# EAGLE design Schematic (EAGLE 9.6.2)

## Sheet 1 of 2
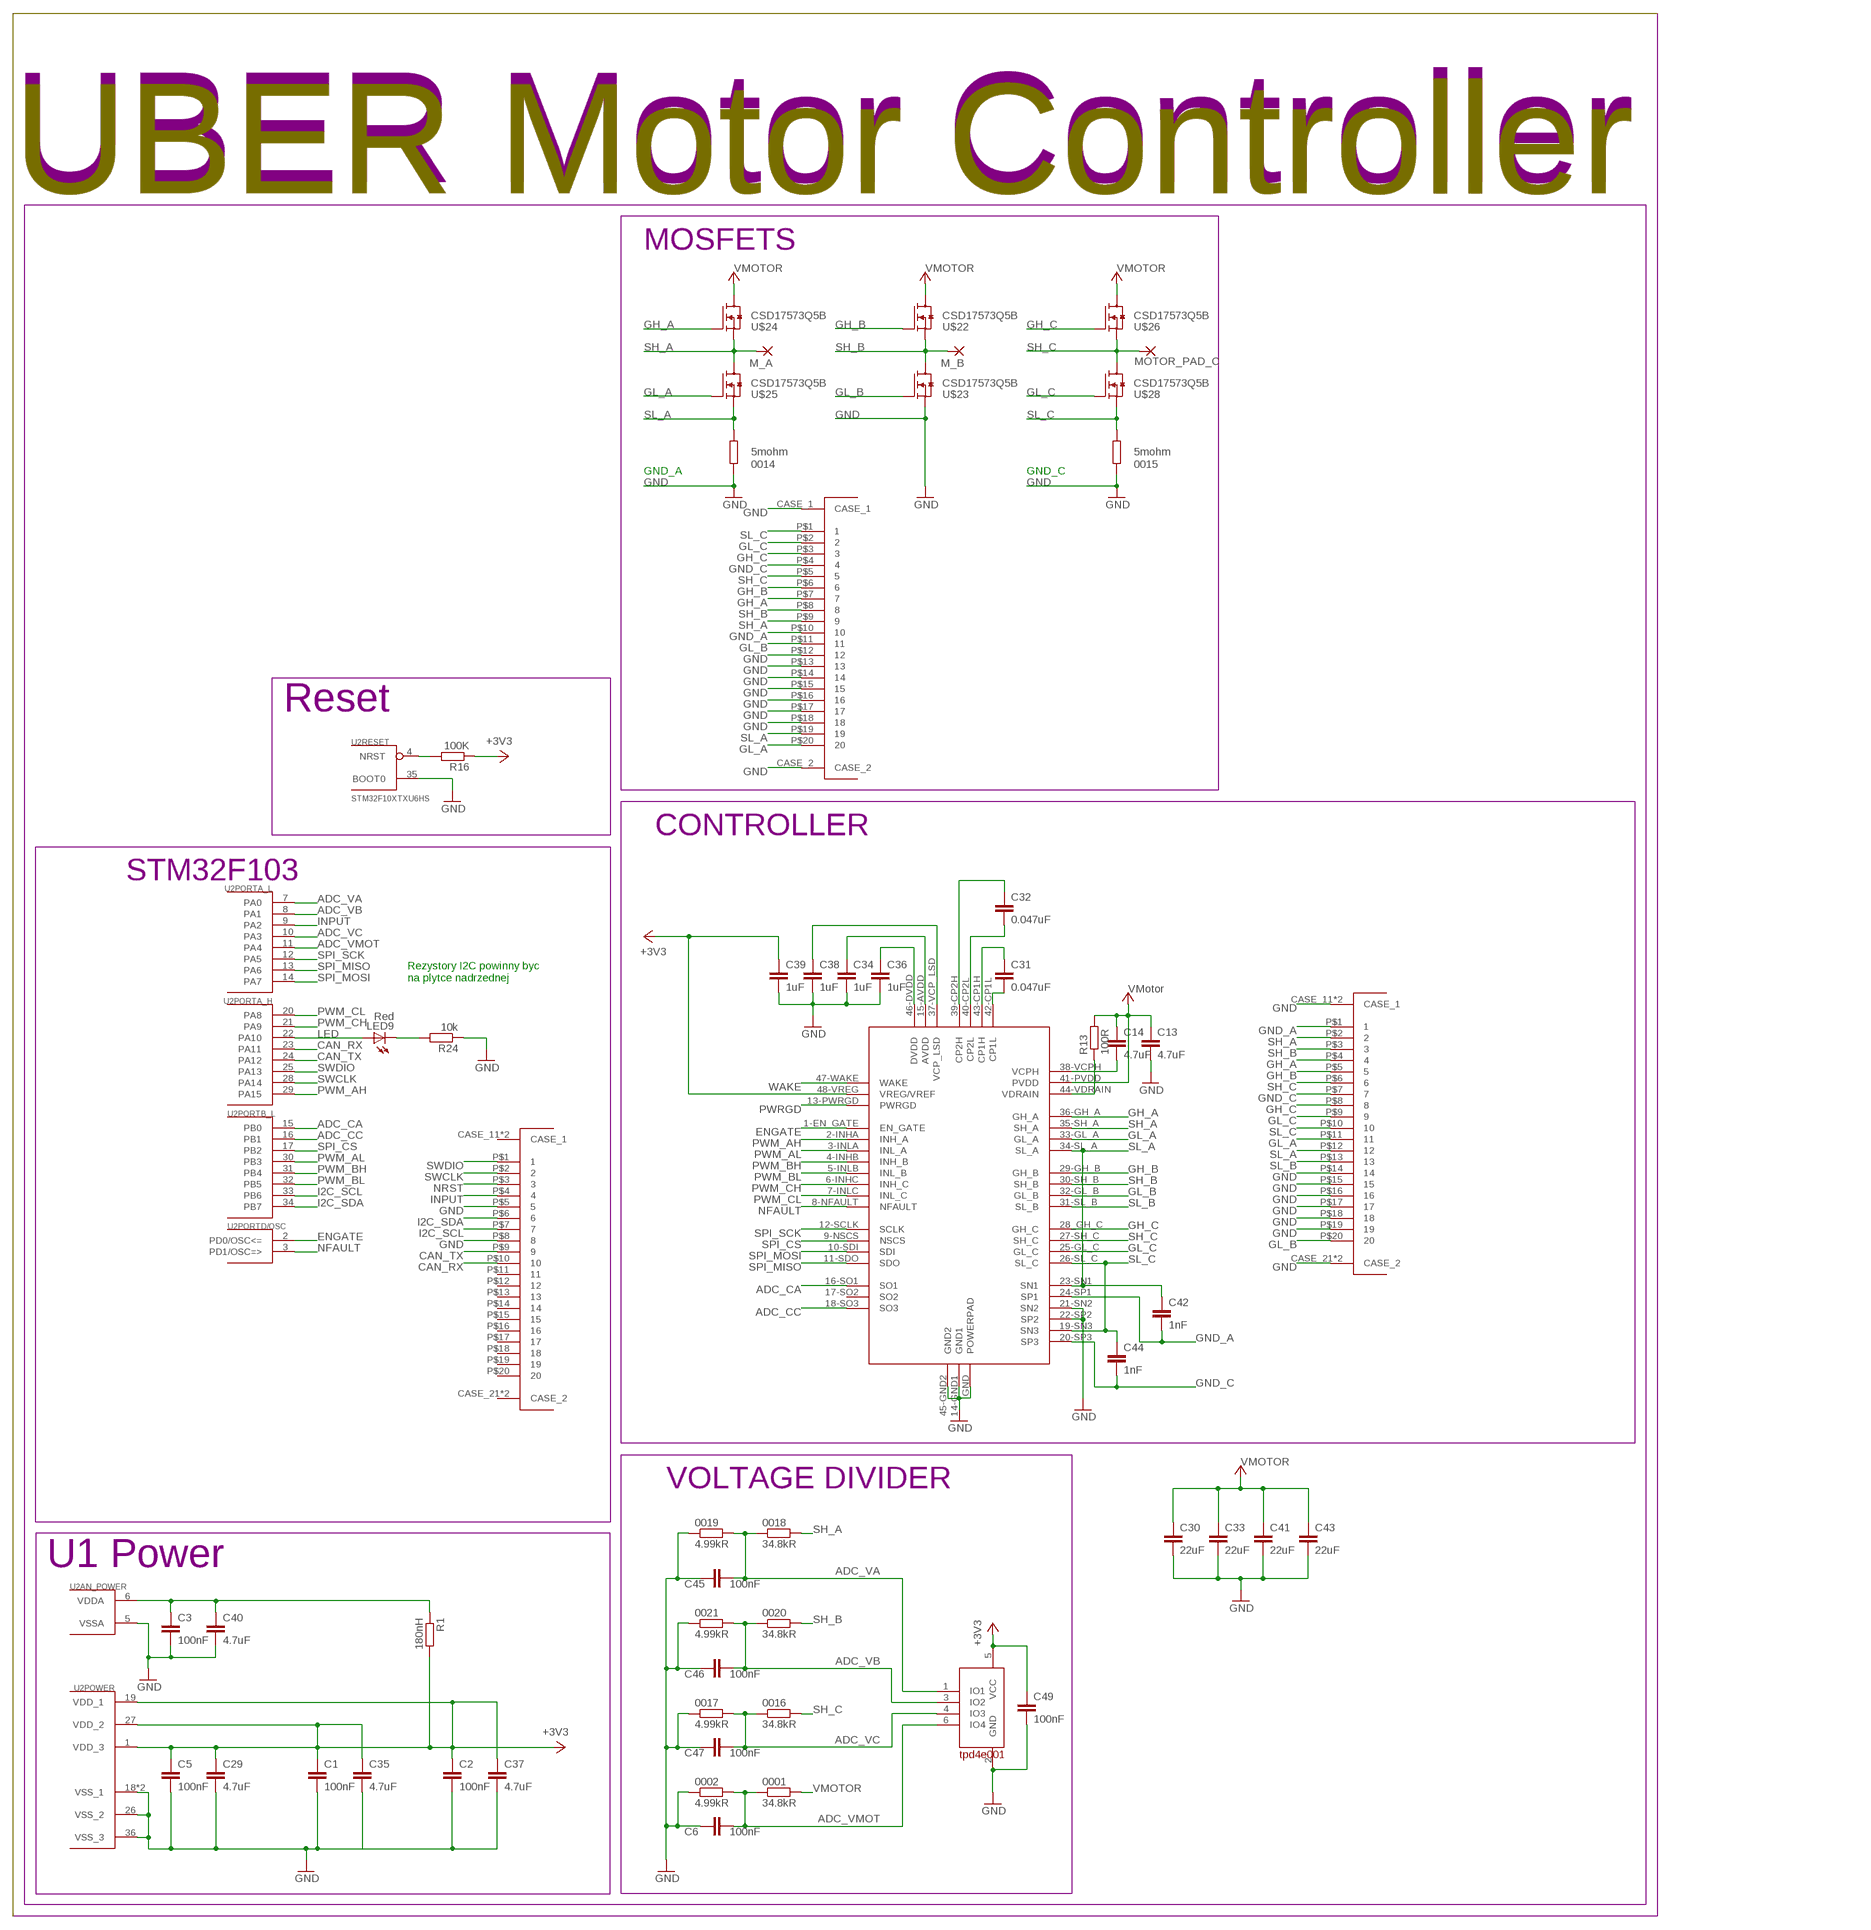
[diagram p0: schematic, sheet 1]

### Parts
0001  34.8kR  R-EU_R0402  [R0402]
0002  4.99kR  R-EU_R0402  [R0402]
0014  5mohm  R-EU_R2512  [R2512]
0015  5mohm  R-EU_R2512  [R2512]
0016  34.8kR  R-EU_R0402  [R0402]
0017  4.99kR  R-EU_R0402  [R0402]
0018  34.8kR  R-EU_R0402  [R0402]
0019  4.99kR  R-EU_R0402  [R0402]
0020  34.8kR  R-EU_R0402  [R0402]
0021  4.99kR  R-EU_R0402  [R0402]
C1  100nF  C-EU  [R0402]
C2  100nF  C-EU  [R0402]
C3  100nF  C-EU  [R0402]
C5  100nF  C-EU  [R0402]
C6  100nF  C-EU  [R0402]
C13  4.7uF  C-EUC0805  [C0805]
C14  4.7uF  C-EUC0805  [C0805]
C29  4.7uF  C-EU  [R0402]
C30  22uF  C-EUC1206  [C1206]
C31  0.047uF  C-EU  [R0402]
C32  0.047uF  C-EU  [R0402]
C33  22uF  C-EUC1206  [C1206]
C34  1uF  C-EU  [R0402]
C35  4.7uF  C-EU  [R0402]
C36  1uF  C-EU  [R0402]
C37  4.7uF  C-EU  [R0402]
C38  1uF  C-EU  [R0402]
C39  1uF  C-EU  [R0402]
C40  4.7uF  C-EU  [R0402]
C41  22uF  C-EUC1206  [C1206]
C42  1nF  C-EU  [R0402]
C43  22uF  C-EUC1206  [C1206]
C44  1nF  C-EU  [R0402]
C45  100nF  C-EU  [R0402]
C46  100nF  C-EU  [R0402]
C47  100nF  C-EU  [R0402]
C49  100nF  C-EU  [R0402]
LED9  Red  LEDSML0603  [SML0603]
M_A  SMD5  [SMD2,54-5,08]
M_B  SMD5  [SMD2,54-5,08]
MOTOR_PAD_C  SMD5  [SMD2,54-5,08]
R1  180nH  R-EU_R0603  [R0603]
R13  100R  R-EU_R0603  [R0603]
R16  100K  R-EU_R0402  [R0402]
R24  10k  R-EU_R0402  [R0402]
U2  STM32F10XTXU6HS  [VFQFPN36-HS]
U$1  RECEPTACLE_20_0.4_5024262030  [RECEPTACLE_20_0.4_5024262030]
U$21  DRV8305  [S-PQFP-G48]
U$22  CSD17573Q5B  [Q5B]
U$23  CSD17573Q5B  [Q5B]
U$24  CSD17573Q5B  [Q5B]
U$25  CSD17573Q5B  [Q5B]
U$26  CSD17573Q5B  [Q5B]
U$28  CSD17573Q5B  [Q5B]
U$30  PLUG_20_0.4_5024302012  [PLUG_20_0.4_5024302012]
U$31  TPD4E001  [SOT-23]
U$32  RECEPTACLE_20_0.4_5024262030  [RECEPTACLE_20_0.4_5024262030]

### Nets
+3V3: C1.1 C2.1 C5.1 C29.1 C35.1 C37.1 C39.1 C49.1 R1.2 R16.1 U2.1(POWER:VDD_3) U2.19(POWER:VDD_1) U2.27(POWER:VDD_2) U$21.48-VREG(VREG/VREF) U$31.5(VCC)
ADC_CA: U2.15(PORTB_L:PB0) U$21.16-SO1(SO1)
ADC_CC: U2.16(PORTB_L:PB1) U$21.18-SO3(SO3)
ADC_VA: 0018.1 0019.2 C45.1 U2.7(PORTA_L:PA0) U$31.1(IO1)
ADC_VB: 0020.1 0021.2 C46.1 U2.8(PORTA_L:PA1) U$31.3(IO2)
ADC_VC: 0016.1 0017.2 C47.1 U2.10(PORTA_L:PA3) U$31.4(IO3)
ADC_VMOT: 0001.1 0002.2 C6.1 U2.11(PORTA_L:PA4) U$31.6(IO4)
CAN_RX: U2.23(PORTA_H:PA11) U$1.P$10
CAN_TX: U2.24(PORTA_H:PA12) U$1.P$9
ENGATE: U2.2(PORTD/OSC:PD0/OSC<=) U$21.1-EN_GATE(EN_GATE)
GH_A: U$21.36-GH_A(GH_A) U$24.G U$30.P$7 U$32.P$4
GH_B: U$21.29-GH_B(GH_B) U$22.G U$30.P$6 U$32.P$5
GH_C: U$21.28_GH_C(GH_C) U$26.G U$30.P$3 U$32.P$8
GL_A: U$21.33-GL_A(GL_A) U$25.G U$30.P$20 U$32.P$11
GL_B: U$21.32-GL_B(GL_B) U$23.G U$30.P$11 U$32.P$20
GL_C: U$21.25-GL_C(GL_C) U$28.G U$30.P$2 U$32.P$9
GND: 0002.1 0014.1 0015.1 0017.1 0019.1 0021.1 C1.2 C2.2 C3.2 C5.2 C6.2 C13.2 C29.2 C30.2 C33.2 C34.2 C35.2 C36.2 C37.2 C38.2 C39.2 C40.2 C41.2 C43.2 C45.2 C46.2 C47.2 C49.2 R24.1 U2.5(AN_POWER:VSSA) U2.18(POWER:VSS_1) U2.26(POWER:VSS_2) U2.35(RESET:BOOT0) U2.36(POWER:VSS_3) U2.GND(POWER:VSS_1) U$1.P$5 U$1.P$8 U$21.14-GND1(GND1) U$21.21-SN2(SN2) U$21.22-SP2(SP2) U$21.45-GND2(GND2) U$21.GND(POWERPAD) U$23.S U$30.CASE_1 U$30.CASE_2 U$30.P$12 U$30.P$13 U$30.P$14 U$30.P$15 U$30.P$16 U$30.P$17 U$30.P$18 U$31.2(GND) U$32.CASE_11(CASE_1) U$32.CASE_12(CASE_1) U$32.CASE_21(CASE_2) U$32.CASE_22(CASE_2) U$32.P$14 U$32.P$15 U$32.P$16 U$32.P$17 U$32.P$18 U$32.P$19
GND_A: C42.2 U$21.24-SP1(SP1) U$30.P$10 U$32.P$1
GND_C: C44.2 U$21.20-SP3(SP3) U$30.P$4 U$32.P$7
I2C_SCL: U2.33(PORTB_L:PB6) U$1.P$7
I2C_SDA: U2.34(PORTB_L:PB7) U$1.P$6
INPUT: U2.9(PORTA_L:PA2) U$1.P$4
LED: LED9.A U2.22(PORTA_H:PA10)
N$2: C3.1 C40.1 R1.1 U2.6(AN_POWER:VDDA)
N$10: C36.1 U$21.46-DVDD(DVDD)
N$12: C34.1 U$21.15-AVDD(AVDD)
N$13: C38.1 U$21.37-VCP_LSD(VCP_LSD)
N$14: C31.2 U$21.42-CP1L(CP1L)
N$16: C31.1 U$21.43-CP1H(CP1H)
N$20: C32.2 U$21.40-CP2L(CP2L)
N$21: C32.1 U$21.39-CP2H(CP2H)
N$22: R13.1 U$21.44-VDRAIN(VDRAIN)
N$23: C14.2 U$21.38-VCPH(VCPH)
N$81: LED9.C R24.2
NFAULT: U2.3(PORTD/OSC:PD1/OSC=>) U$21.8-NFAULT(NFAULT)
NRST: R16.2 U2.4(RESET:NRST) U$1.P$3
PWM_AH: U2.29(PORTA_H:PA15) U$21.2-INHA(INH_A)
PWM_AL: U2.30(PORTB_L:PB3) U$21.3-INLA(INL_A)
PWM_BH: U2.31(PORTB_L:PB4) U$21.4-INHB(INH_B)
PWM_BL: U2.32(PORTB_L:PB5) U$21.5-INLB(INL_B)
PWM_CH: U2.21(PORTA_H:PA9) U$21.6-INHC(INH_C)
PWM_CL: U2.20(PORTA_H:PA8) U$21.7-INLC(INL_C)
PWRGD: U$21.13-PWRGD(PWRGD)
SH_A: 0018.2 M_A.1(P) U$21.35-SH_A(SH_A) U$24.S U$25.D U$30.P$9 U$32.P$2
SH_B: 0020.2 M_B.1(P) U$21.30-SH_B(SH_B) U$22.S U$23.D U$30.P$8 U$32.P$3
SH_C: 0016.2 MOTOR_PAD_C.1(P) U$21.27-SH_C(SH_C) U$26.S U$28.D U$30.P$5 U$32.P$6
SL_A: 0014.2 C42.1 U$21.23-SN1(SN1) U$21.34-SL_A(SL_A) U$25.S U$30.P$19 U$32.P$12
SL_B: U$21.31-SL_B(SL_B) U$32.P$13
SL_C: 0015.2 C44.1 U$21.19-SN3(SN3) U$21.26-SL_C(SL_C) U$28.S U$30.P$1 U$32.P$10
SPI_CS: U2.17(PORTB_L:PB2) U$21.9-NSCS(NSCS)
SPI_MISO: U2.13(PORTA_L:PA6) U$21.11-SDO(SDO)
SPI_MOSI: U2.14(PORTA_L:PA7) U$21.10-SDI(SDI)
SPI_SCK: U2.12(PORTA_L:PA5) U$21.12-SCLK(SCLK)
SWCLK: U2.28(PORTA_H:PA14) U$1.P$2
SWDIO: U2.25(PORTA_H:PA13) U$1.P$1
VMOTOR: 0001.2 C13.1 C14.1 C30.1 C33.1 C41.1 C43.1 R13.2 U$21.41-PVDD(PVDD) U$22.D U$24.D U$26.D ; supply symbol labelled VMotor
WAKE: U$21.47-WAKE(WAKE)
Unconnected: U$1.CASE_11(CASE_1) U$1.CASE_12(CASE_1) U$1.CASE_21(CASE_2) U$1.CASE_22(CASE_2) U$1.P$11 U$1.P$12 U$1.P$13 U$1.P$14 U$1.P$15 U$1.P$16 U$1.P$17 U$1.P$18 U$1.P$19 U$1.P$20 U$21.17-SO2(SO2)

### Notes on the sheet
- UBER Motor Controller | UBER Motor Controller
- MOSFETS
- GND_A | GND_C
- Reset
- CONTROLLER
- STM32F103
- Rezystory I2C powinny byc 
  na plytce nadrzednej
- VOLTAGE DIVIDER
- U1 Power

## Sheet 2 of 2
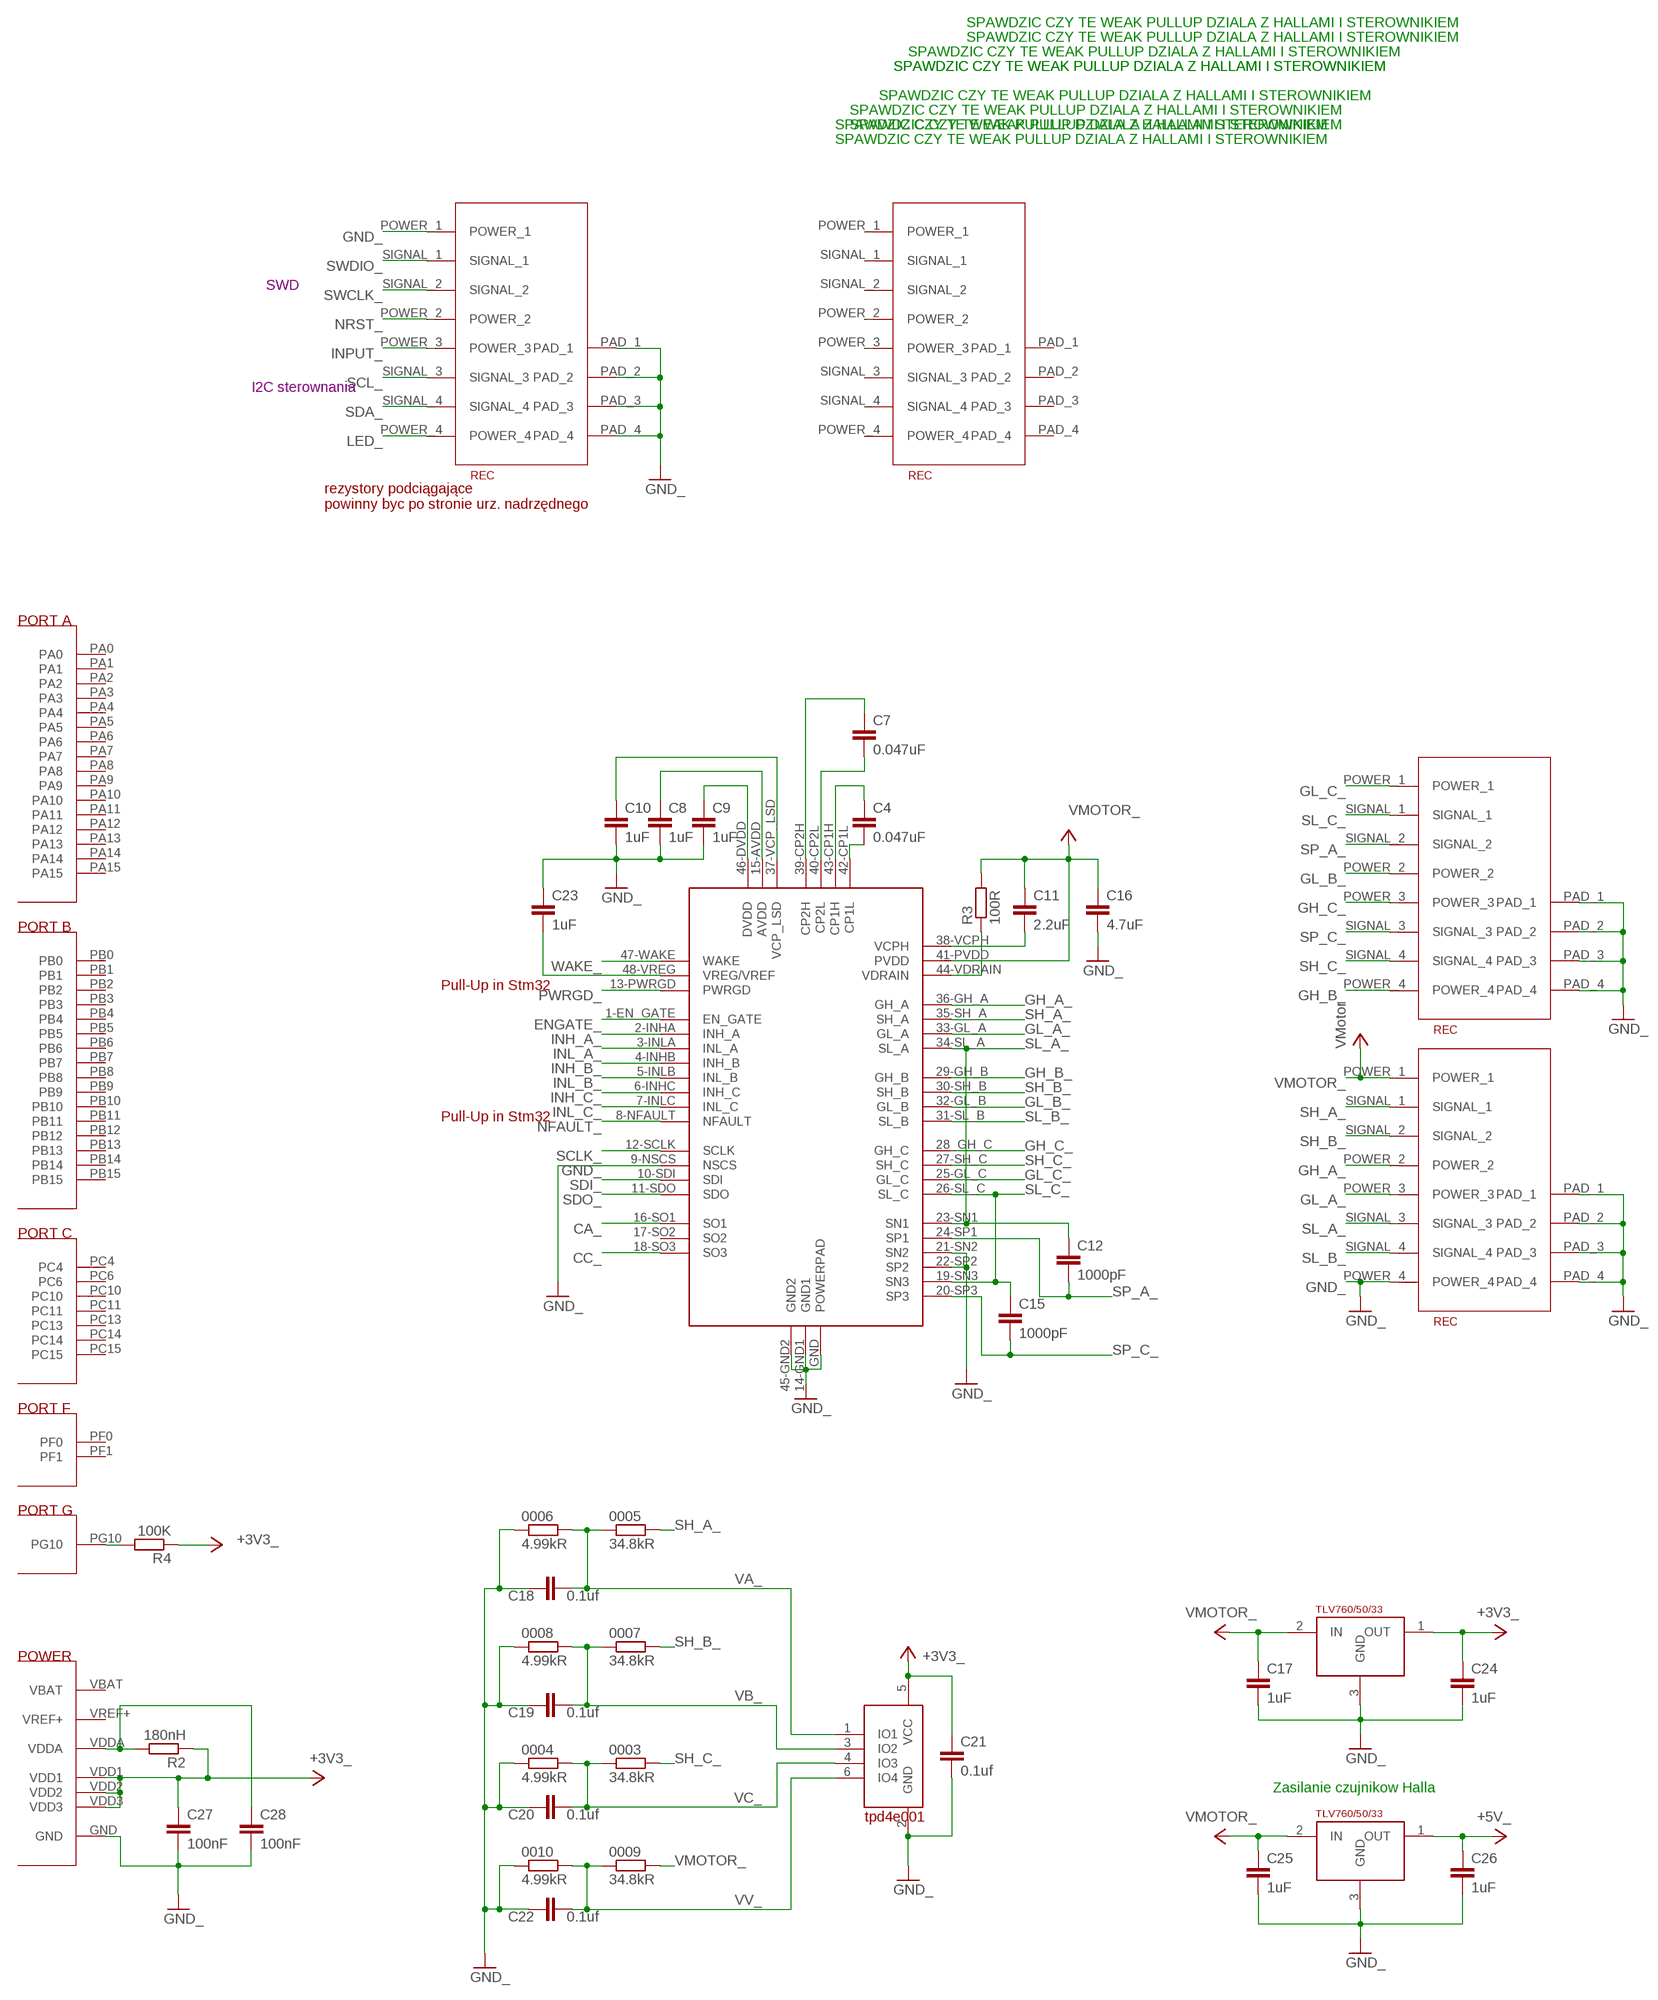
[diagram p1: schematic, sheet 2, part 1 of 2]
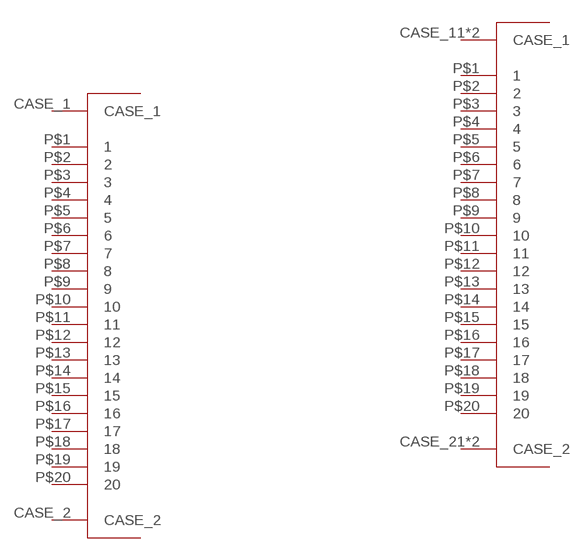
[diagram p2: schematic, sheet 2, part 2 of 2]

### Parts
0003  34.8kR  R-EU_R0402  [R0402]
0004  4.99kR  R-EU_R0402  [R0402]
0005  34.8kR  R-EU_R0402  [R0402]
0006  4.99kR  R-EU_R0402  [R0402]
0007  34.8kR  R-EU_R0402  [R0402]
0008  4.99kR  R-EU_R0402  [R0402]
0009  34.8kR  R-EU_R0402  [R0402]
0010  4.99kR  R-EU_R0402  [R0402]
C4  0.047uF  C-EUC0603  [C0603]
C7  0.047uF  C-EUC0603  [C0603]
C8  1uF  C-EUC0603  [C0603]
C9  1uF  C-EUC0603  [C0603]
C10  1uF  C-EUC0603  [C0603]
C11  2.2uF  C-EUC0603  [C0603]
C12  1000pF  C-EUC0603  [C0603]
C15  1000pF  C-EUC0603  [C0603]
C16  4.7uF  C-EUC0805  [C0805]
C17  1uF  C-EUC0603  [C0603]
C18  0.1uf  C-EUC0402  [C0402]
C19  0.1uf  C-EUC0402  [C0402]
C20  0.1uf  C-EUC0402  [C0402]
C21  0.1uf  C-EUC0603  [C0603]
C22  0.1uf  C-EUC0402  [C0402]
C23  1uF  C-EUC0603  [C0603]
C24  1uF  C-EUC0603  [C0603]
C25  1uF  C-EUC0603  [C0603]
C26  1uF  C-EUC0603  [C0603]
C27  100nF  C-EUC0603  [C0603]
C28  100nF  C-EUC0603  [C0603]
R2  180nH  R-EU_R0603  [R0603]
R3  100R  R-EU_R0603  [R0603]
R4  100K  R-EU_R0603  [R0603]
U$12  STM32G473CC  [VFQFPN36]
U$13  DRV8305  [S-PQFP-G48]
U$14  MOLEG_REC_8X0.4MM  [REC]
U$15  MOLEG_REC_8X0.4MM  [REC]
U$16  TPD4E001  [SOT-23]
U$17  TLV760XX  [SOT-23-3]
U$18  MOLEG_REC_8X0.4MM  [REC]
U$19  MOLEG_REC_8X0.4MM  [REC]
U$20  TLV760XX  [SOT-23-3]
U$27  PLUG_20_0.4_5024302012  [PLUG_20_0.4_5024302012]
U$29  RECEPTACLE_20_0.4_5024262030  [RECEPTACLE_20_0.4_5024262030]

### Nets
+3V3_: C21.1 C24.1 C27.1 R2.1 R4.1 U$12.VDD1 U$12.VDD2 U$12.VDD3 U$16.5(VCC) U$17.1(OUT) ; supply symbol labelled +3V3
+5V_: C26.1 U$20.1(OUT) ; supply symbol labelled +3V3
CA_: U$13.16-SO1(SO1)
CC_: U$13.18-SO3(SO3)
ENGATE_: U$13.1-EN_GATE(EN_GATE)
GH_A_: U$13.36-GH_A(GH_A) U$15.POWER_2
GH_B_: U$13.29-GH_B(GH_B) U$14.POWER_4
GH_C_: U$13.28_GH_C(GH_C) U$14.POWER_3
GL_A_: U$13.33-GL_A(GL_A) U$15.POWER_3
GL_B_: U$13.32-GL_B(GL_B) U$14.POWER_2
GL_C_: U$13.25-GL_C(GL_C) U$14.POWER_1
GND_: 0004.1 0006.1 0008.1 0010.1 C8.2 C9.2 C10.2 C16.2 C17.2 C18.2 C19.2 C20.2 C21.2 C22.2 C23.1 C24.2 C25.2 C26.2 C27.2 C28.2 U$12.GND U$13.9-NSCS(NSCS) U$13.14-GND1(GND1) U$13.21-SN2(SN2) U$13.22-SP2(SP2) U$13.45-GND2(GND2) U$13.GND(POWERPAD) U$14.PAD_1 U$14.PAD_2 U$14.PAD_3 U$14.PAD_4 U$15.PAD_1 U$15.PAD_2 U$15.PAD_3 U$15.PAD_4 U$15.POWER_4 U$16.2(GND) U$17.3(GND) U$18.PAD_1 U$18.PAD_2 U$18.PAD_3 U$18.PAD_4 U$18.POWER_1 U$20.3(GND) ; supply symbol labelled GND
INH_A_: U$13.2-INHA(INH_A)
INH_B_: U$13.4-INHB(INH_B)
INH_C_: U$13.6-INHC(INH_C)
INL_A_: U$13.3-INLA(INL_A)
INL_B_: U$13.5-INLB(INL_B)
INL_C_: U$13.7-INLC(INL_C)
INPUT_: U$18.POWER_3
LED_: U$18.POWER_4
N$30: C9.1 U$13.46-DVDD(DVDD)
N$31: C8.1 U$13.15-AVDD(AVDD)
N$32: C10.1 U$13.37-VCP_LSD(VCP_LSD)
N$33: C4.2 U$13.42-CP1L(CP1L)
N$34: C4.1 U$13.43-CP1H(CP1H)
N$35: C7.2 U$13.40-CP2L(CP2L)
N$36: C7.1 U$13.39-CP2H(CP2H)
N$38: R3.1 U$13.44-VDRAIN(VDRAIN)
N$39: C11.2 U$13.38-VCPH(VCPH)
N$40: C23.2 U$13.48-VREG(VREG/VREF)
N$41: R4.2 U$12.PG10
N$48: C28.1 R2.2 U$12.VDDA
NFAULT_: U$13.8-NFAULT(NFAULT)
NRST_: U$18.POWER_2
PWRGD_: U$13.13-PWRGD(PWRGD)
SCL_: U$18.SIGNAL_3
SCLK_: U$13.12-SCLK(SCLK)
SDA_: U$18.SIGNAL_4
SDI_: U$13.10-SDI(SDI)
SDO_: U$13.11-SDO(SDO)
SH_A_: 0005.2 U$13.35-SH_A(SH_A) U$15.SIGNAL_1
SH_B_: 0007.2 U$13.30-SH_B(SH_B) U$15.SIGNAL_2
SH_C_: 0003.2 U$13.27-SH_C(SH_C) U$14.SIGNAL_4
SL_A_: C12.1 U$13.23-SN1(SN1) U$13.34-SL_A(SL_A) U$15.SIGNAL_3
SL_B_: U$13.31-SL_B(SL_B) U$15.SIGNAL_4
SL_C_: C15.1 U$13.19-SN3(SN3) U$13.26-SL_C(SL_C) U$14.SIGNAL_1
SP_A_: C12.2 U$13.24-SP1(SP1) U$14.SIGNAL_2
SP_C_: C15.2 U$13.20-SP3(SP3) U$14.SIGNAL_3
SWCLK_: U$18.SIGNAL_2
SWDIO_: U$18.SIGNAL_1
VA_: 0005.1 0006.2 C18.1 U$16.1(IO1)
VB_: 0007.1 0008.2 C19.1 U$16.3(IO2)
VC_: 0003.1 0004.2 C20.1 U$16.4(IO3)
VMOTOR_: 0009.2 C11.1 C16.1 C17.1 C25.1 R3.2 U$13.41-PVDD(PVDD) U$15.POWER_1 U$17.2(IN) U$20.2(IN) ; supply symbol labelled VMotor
VV_: 0009.1 0010.2 C22.1 U$16.6(IO4)
WAKE_: U$13.47-WAKE(WAKE)
Unconnected: U$12.PA0 U$12.PA1 U$12.PA2 U$12.PA3 U$12.PA4 U$12.PA5 U$12.PA6 U$12.PA7 U$12.PA8 U$12.PA9 U$12.PA10 U$12.PA11 U$12.PA12 U$12.PA13 U$12.PA14 U$12.PA15 U$12.PB0 U$12.PB1 U$12.PB2 U$12.PB3 U$12.PB4 U$12.PB5 U$12.PB6 U$12.PB7 U$12.PB8 U$12.PB9 U$12.PB10 U$12.PB11 U$12.PB12 U$12.PB13 U$12.PB14 U$12.PB15 U$12.PC4 U$12.PC6 U$12.PC10 U$12.PC11 U$12.PC13 U$12.PC14 U$12.PC15 U$12.PF0 U$12.PF1 U$12.VBAT U$12.VREF+ U$13.17-SO2(SO2) U$19.PAD_1 U$19.PAD_2 U$19.PAD_3 U$19.PAD_4 U$19.POWER_1 U$19.POWER_2 U$19.POWER_3 U$19.POWER_4 U$19.SIGNAL_1 U$19.SIGNAL_2 U$19.SIGNAL_3 U$19.SIGNAL_4 U$27.CASE_1 U$27.CASE_2 U$27.P$1 U$27.P$2 U$27.P$3 U$27.P$4 U$27.P$5 U$27.P$6 U$27.P$7 U$27.P$8 U$27.P$9 U$27.P$10 U$27.P$11 U$27.P$12 U$27.P$13 U$27.P$14 U$27.P$15 U$27.P$16 U$27.P$17 U$27.P$18 U$27.P$19 U$27.P$20 U$29.CASE_11(CASE_1) U$29.CASE_12(CASE_1) U$29.CASE_21(CASE_2) U$29.CASE_22(CASE_2) U$29.P$1 U$29.P$2 U$29.P$3 U$29.P$4 U$29.P$5 U$29.P$6 U$29.P$7 U$29.P$8 U$29.P$9 U$29.P$10 U$29.P$11 U$29.P$12 U$29.P$13 U$29.P$14 U$29.P$15 U$29.P$16 U$29.P$17 U$29.P$18 U$29.P$19 U$29.P$20

### Notes on the sheet
- SPAWDZIC CZY TE WEAK PULLUP DZIALA Z HALLAMI I STEROWNIKIEM
- SPAWDZIC CZY TE WEAK PULLUP DZIALA Z HALLAMI I STEROWNIKIEM
- SPAWDZIC CZY TE WEAK PULLUP DZIALA Z HALLAMI I STEROWNIKIEM
- SPAWDZIC CZY TE WEAK PULLUP DZIALA Z HALLAMI I STEROWNIKIEM | SPAWDZIC CZY TE WEAK PULLUP DZIALA Z HALLAMI I STEROWNIKIEM
- SPAWDZIC CZY TE WEAK PULLUP DZIALA Z HALLAMI I STEROWNIKIEM
- SPAWDZIC CZY TE WEAK PULLUP DZIALA Z HALLAMI I STEROWNIKIEM
- SPAWDZIC CZY TE WEAK PULLUP DZIALA Z HALLAMI I STEROWNIKIEM | SPAWDZIC CZY TE WEAK PULLUP DZIALA Z HALLAMI I STEROWNIKIEM
- SPAWDZIC CZY TE WEAK PULLUP DZIALA Z HALLAMI I STEROWNIKIEM
- SWD
- I2C sterownania
- rezystory podciągające 
  powinny byc po stronie urz. nadrzędnego
- Pull-Up in Stm32
- Pull-Up in Stm32
- Zasilanie czujnikow Halla

## Library data of the parts
0001-0009 0010 0016-0021 R16 R24 = rcl:R-EU_: RESISTOR, European symbol; SPICEPREFIX: R
0014 0015 R1-R4 R13 = resistor:R-EU_: RESISTOR, European symbol
C1-C3 C5 C6 C29 C31 C32 C34-C40 C42 C44-C47 C49 = rcl:C-EU: CAPACITOR, European symbol
C4 C7-C28 C30 C33 C41 C43 = rcl:C-EU: CAPACITOR, European symbol; SPICEPREFIX: C
LED9 = led:LED: LED OSRAM: - CHIPLED LG R971, LG N971, LY N971, LG Q971, LY Q971, LO R971, LY R971 LH N974, LH R974 LS Q976, LO Q976, LY Q976 LO Q996 - Hyper CHIPLED LW Q18S LB Q993, LB Q99A, LB R99A - SideLED LS A670, LO A670, LY A670, LG A670, LP A670 LB A673, LV A673, LT A673, LW A673 LH A674 LY A675 LS A676, LA A676, LO A676, LY A676, LW A676 LS A679, LY A679, LG A679 - Hyper Micro SIDELED® LS Y876, LA Y876, LO Y876, LY Y876 LT Y87S - SmartLED LW L88C, LW L88S LB L89C, LB L89S, LG L890 LS L89K, LO L89K, LY L89K LS L896, LA L896, LO L896, LY L896 - TOPLED LS T670, LO T670, LY T670, LG T670, LP T670 LSG T670, LSP T670, LSY T670, LOP T670, LYG T670 LG T671, LOG T671, LSG T671 LB T673, LV T673, LT T673, LW T673 LH T674 LS T676, LA T676, LO T676, LY T676, LB T676, LH T676, LSB T676, LW T676 LB T67C, LV T67C, LT T67C, LS T67K, LO T67K, LY T67K, LW E67C LS E67B, LA E67B, LO E67B, LY E67B, LB E67C, LV E67C, LT E67C LW T67C LS T679, LY T679, LG T679 LS T770, LO T770, LY T770, LG T770, LP T770 LB T773, LV T773, LT T773, LW T773 LH T774 LS E675, LA E675, LY E675, LS T675 LS T776, LA T776, LO T776, LY T776, LB T776 LHGB T686 LT T68C, LB T68C - Hyper Mini TOPLED® LB M676 - Mini TOPLED Santana® LG M470 LS M47K, LO M47K, LY M47K Source: http://www.osram.convergy.de LUXEON: - LUMILED® LXK2-PW12-R00, LXK2-PW12-S00, LXK2-PW14-U00, LXK2-PW14-V00 LXK2-PM12-R00, LXK2-PM12-S00, LXK2-PM14-U00 LXK2-PE12-Q00, LXK2-PE12-R00, LXK2-PE12-S00, LXK2-PE14-T00, LXK2-PE14-U00 LXK2-PB12-K00, LXK2-PB12-L00, LXK2-PB12-M00, LXK2-PB14-N00, LXK2-PB14-P00, LXK2-PB14-Q00 LXK2-PR12-L00, LXK2-PR12-M00, LXK2-PR14-Q00, LXK2-PR14-R00 LXK2-PD12-Q00, LXK2-PD12-R00, LXK2-PD12-S00 LXK2-PH12-R00, LXK2-PH12-S00 LXK2-PL12-P00, LXK2-PL12-Q00, LXK2-PL12-R00 Source: www.luxeon.com KINGBRIGHT: KA-3528ASYC Source: www.kingbright.com
M_A M_B MOTOR_PAD_C = wirepad:SMD5: SMD PAD
U2 = stm32:STM32F10XTXU6: STM32F101/103 36pad VFQPFN36
U$1 U$29 U$32 = Molex_2:RECEPTACLE_20_0.4_5024262030
U$12 = STM32G473CC:STM32G473CC
U$13 U$21 = drv8305lbr:DRV8305
U$14 U$15 U$18 U$19 = MOLEX:MOLEG_REC_8X0.4MM
U$16 U$31 = tpd4e001:TPD4E001
U$17 U$20 = Zestaw:TLV760XX
U$22-U$26 U$28 = CSD_Mosfet:CSD17573Q5B
U$27 U$30 = Molex_2:PLUG_20_0.4_5024302012

## Board
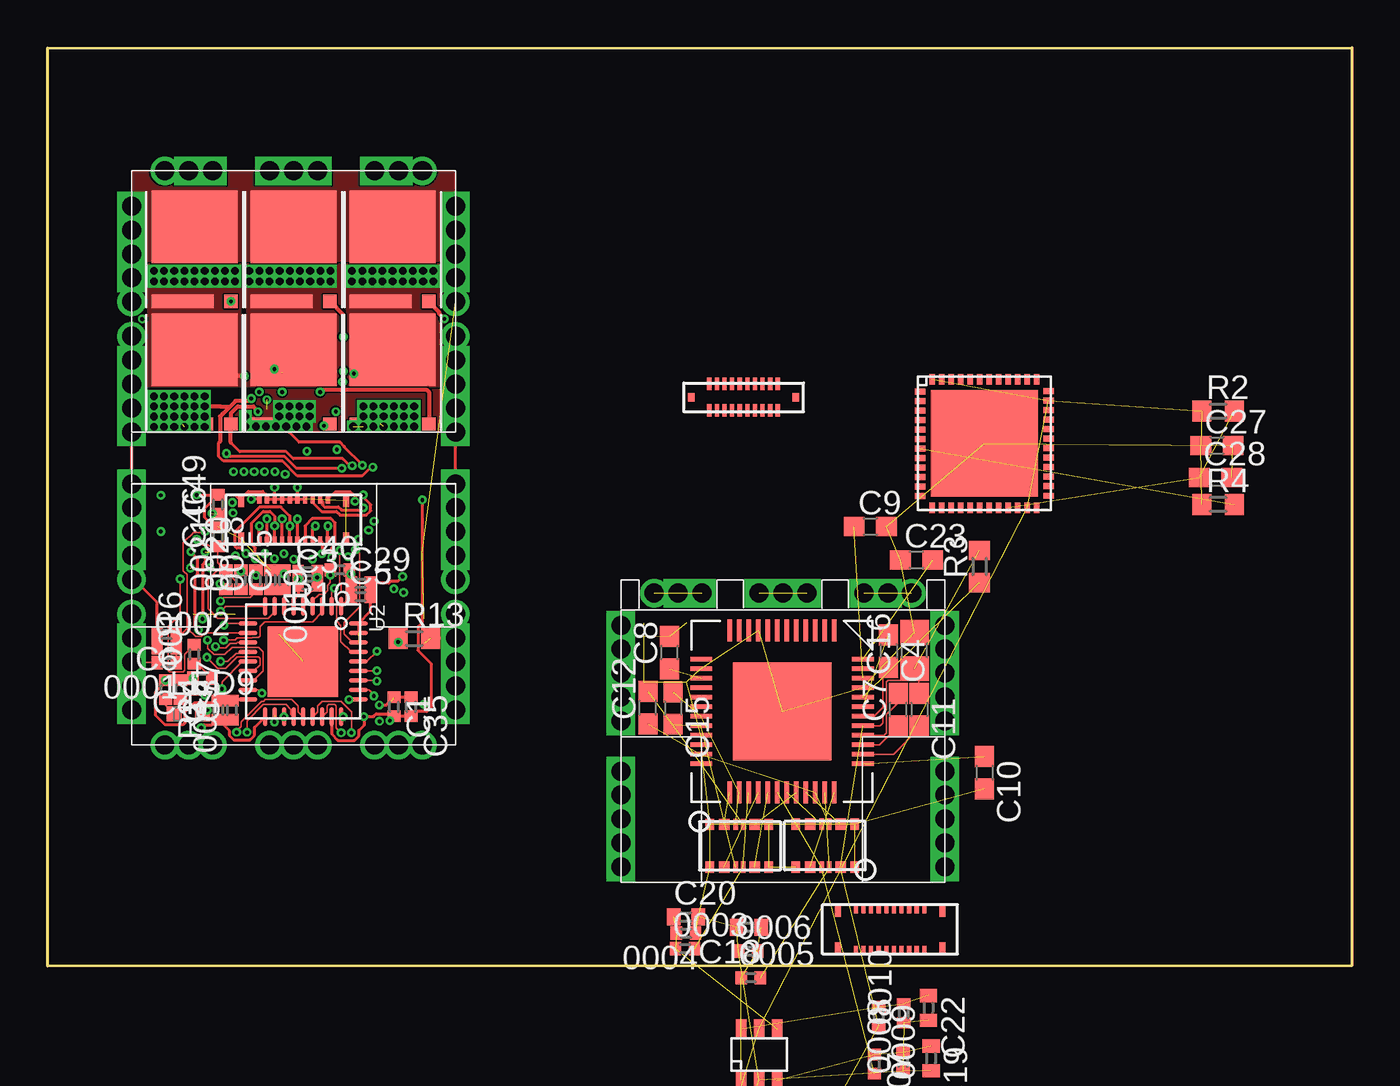
[diagram p3: board, top side]
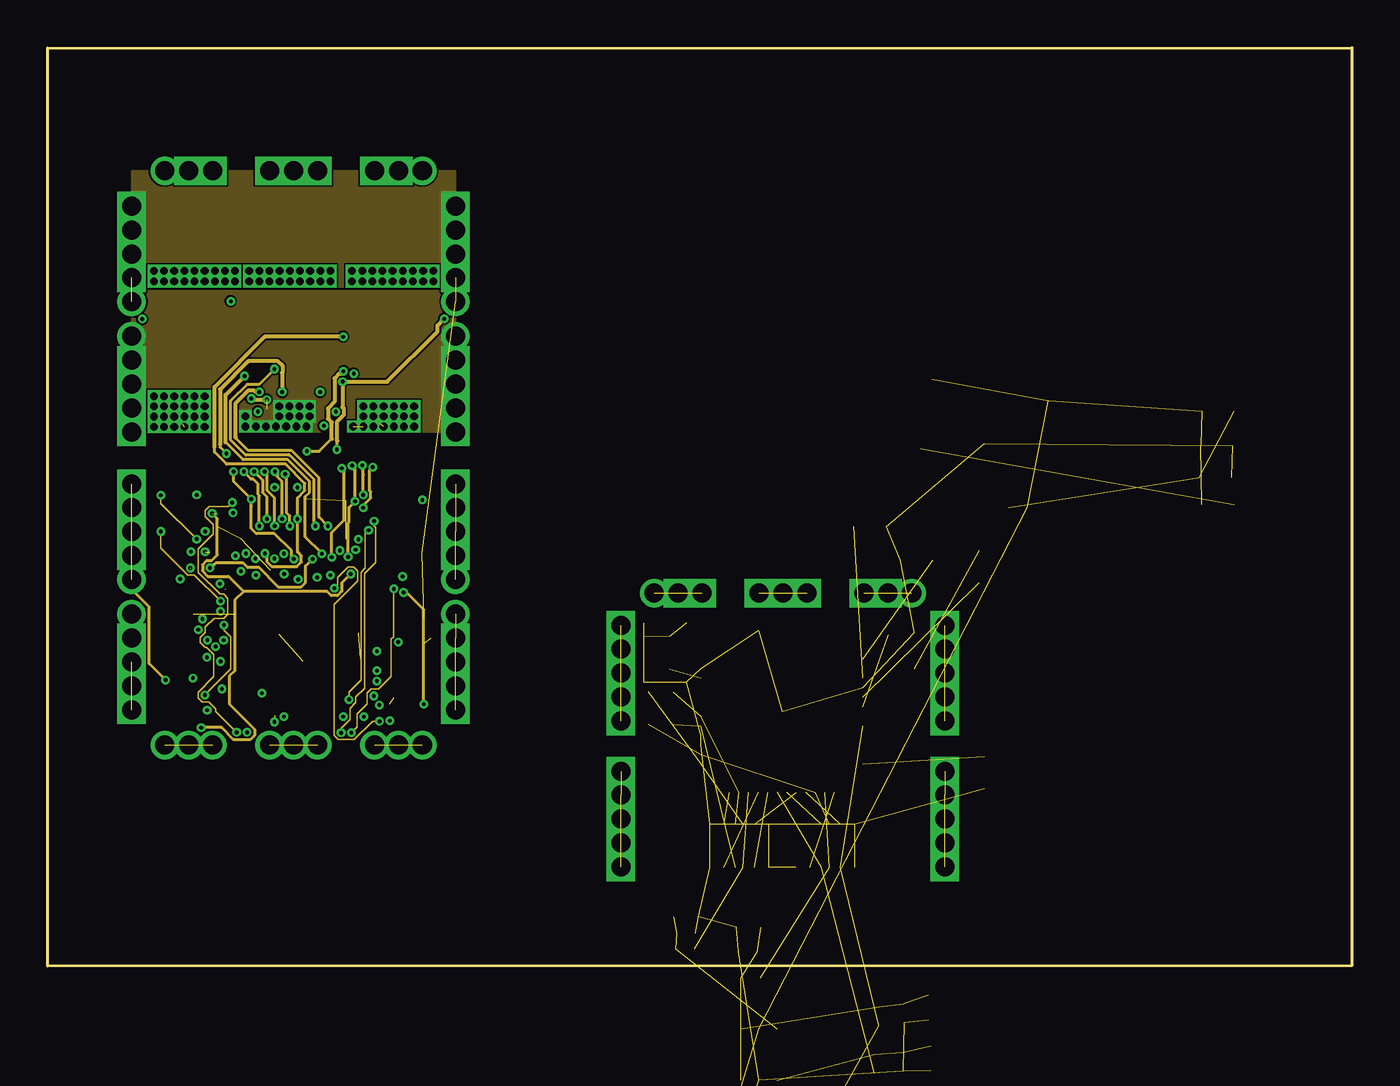
[diagram p4: board, inner layer Route2]
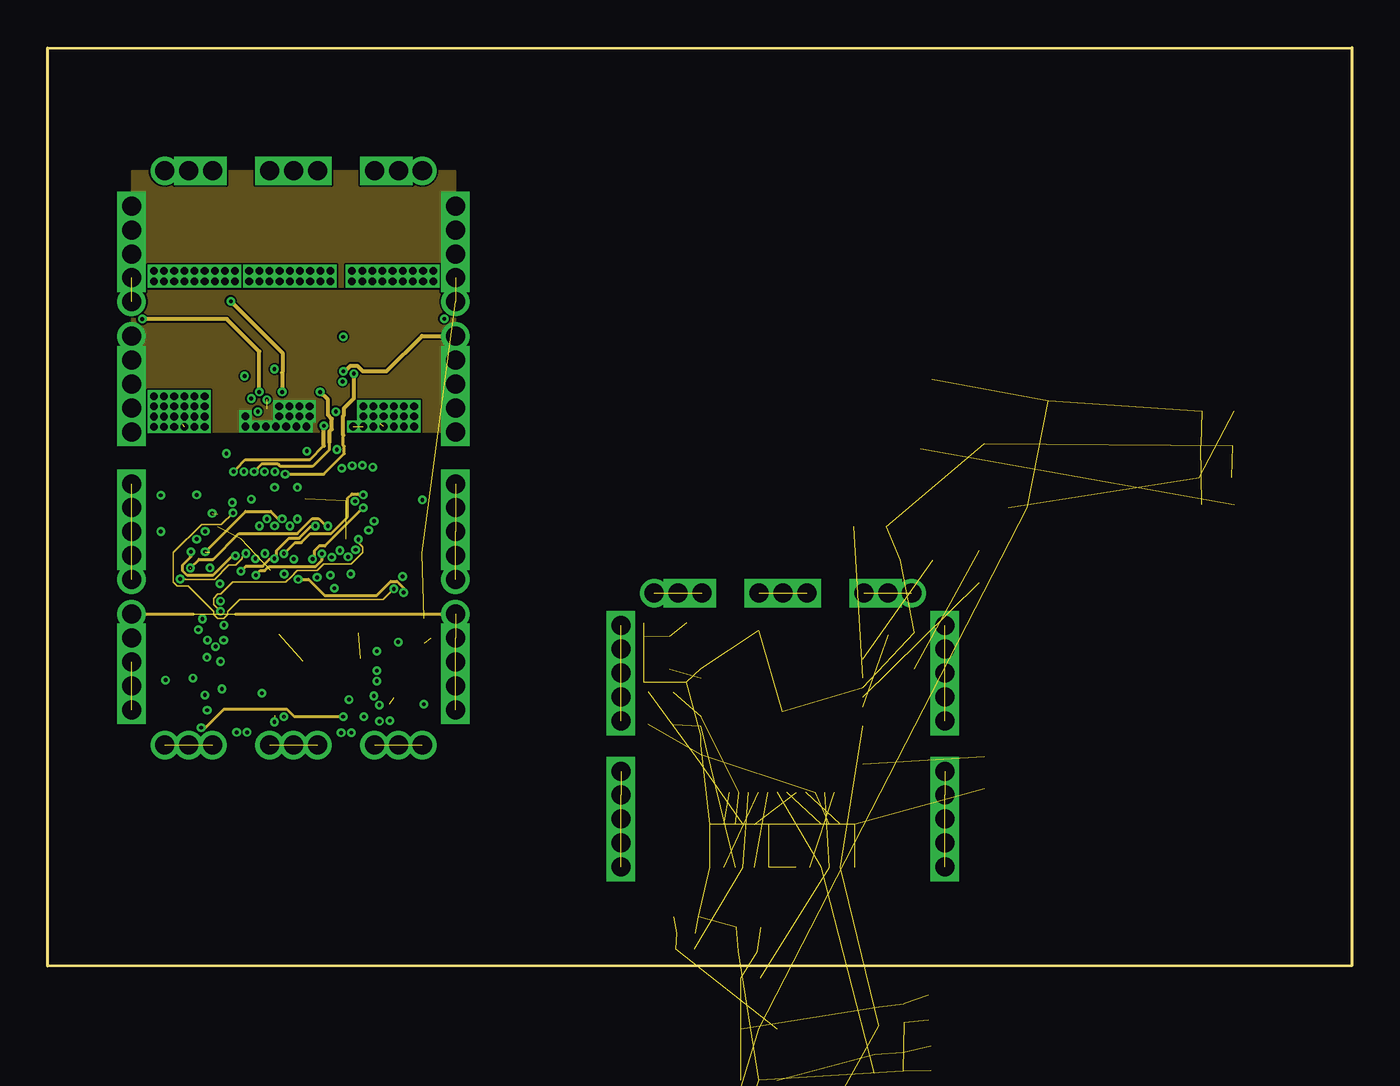
[diagram p5: board, inner layer Route15]
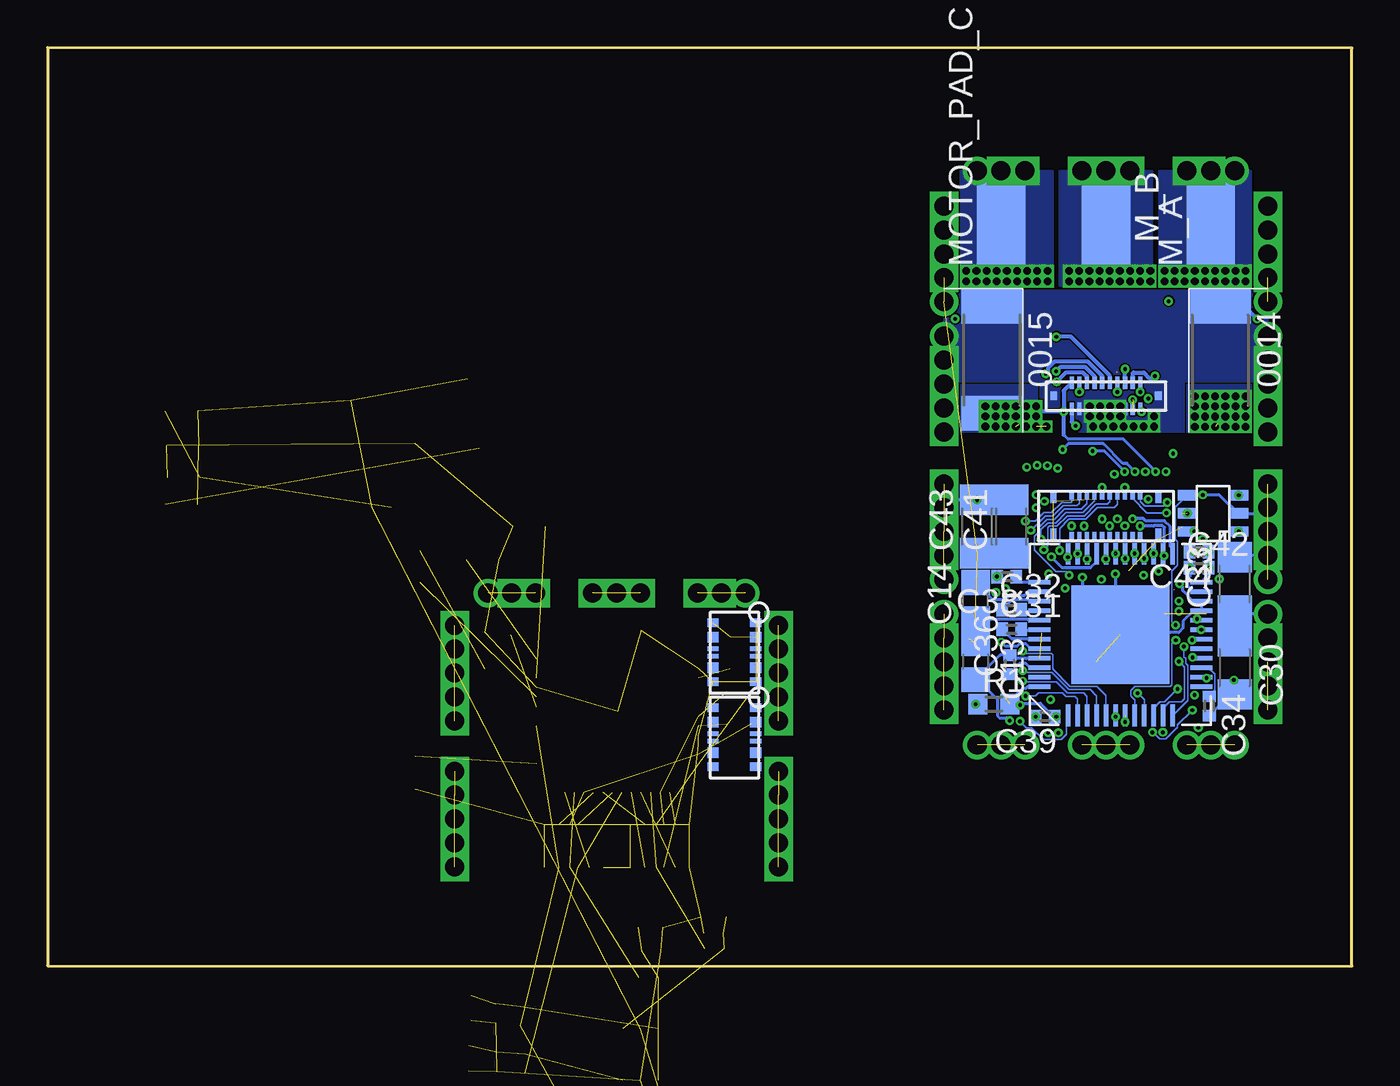
[diagram p6: board, bottom side, seen from below]

Size 68.55 x 48.29 mm. Coordinates in mm from the lower left corner, seen from the top.
Outline: 0,0 0,48.26 68.55,48.29 68.55,0.02 0,0
Copper layers (1*2*15*16): Top 0.035mm / dielectric 0.2mm / Route2 0.017mm / dielectric 0.2mm / Route15 0.017mm / dielectric 0.2mm / Bottom 0.035mm
Design rules "default *": minimum track width 3.5mil, minimum drill 0.2mm, track to track 3.5mil, track to pad 3.5mil, pad to pad 3.5mil, via to via 3.5mil, smd to smd 0mil, copper to edge 0mil, drill to drill 0mil, minimum pad ring 5mil, minimum via ring 5mil, stop-mask expansion 1mil, vias tented up to drill 0mil, thermal gap 0mil

### Footprints (pad centres in the part's own frame; a part is rotated, then mirrored left to right if it is on the bottom)
R0402 = smd 0.6 x 0.7: 1 -0.5,0; 2 0.5,0
R2512 = smd 1.8 x 3.2: 1 -2.8,0; 2 2.8,0
C0603 = smd 1.1 x 1: 1 -0.85,0; 2 0.85,0
C0805 = smd 1.3 x 1.5: 1 -0.95,0; 2 0.95,0
C0402 = smd 0.7 x 0.9: 1 -0.65,0; 2 0.65,0
C1206 = smd 1.6 x 1.8: 1 -1.4,0; 2 1.4,0
SML0603 = smd 0.8 x 0.8: A 0.75,0; C -0.75,0
SMD2,54-5,08 = smd 2.54 x 5.08: 1 0,0
R0603 = smd 1 x 1.1: 1 -0.85,0; 2 0.85,0
VFQFPN36-HS = smd 1 x 0.23: 1 -2.9,2; 2 -2.9,1.5; 3 -2.9,1; 4 -2.9,0.5; 5 -2.9,0; 6 -2.9,-0.5; 7 -2.9,-1; 8 -2.9,-1.5; 9 -2.9,-2; 19 2.9,-2; 20 2.9,-1.5; 21 2.9,-1; 22 2.9,-0.5; 23 2.9,0; 24 2.9,0.5; 25 2.9,1; 26 2.9,1.5; 27 2.9,2 | smd 0.23 x 1: 10 -2,-2.9; 11 -1.5,-2.9; 12 -1,-2.9; 13 -0.5,-2.9; 14 0,-2.9; 15 0.5,-2.9; 16 1,-2.9; 17 1.5,-2.9; 18 2,-2.9; 28 2,2.9; 29 1.5,2.9; 30 1,2.9; 31 0.5,2.9; 32 0,2.9; 33 -0.5,2.9; 34 -1,2.9; 35 -1.5,2.9; 36 -2,2.905 | smd 3.7 x 3.7: GND 0,0
RECEPTACLE_20_0.4_5024262030 = smd 0.32 x 0.65: CASE_11 -0.95,-0.1; CASE_12 -0.95,-2.1; CASE_21 4.55,-0.1; CASE_22 4.55,-2.1 | smd 0.22 x 0.475: P$1 0,0; P$2 0.4,0; P$3 0.8,0; P$4 1.2,0; P$5 1.6,0; P$6 2,0; P$7 2.4,0; P$8 2.8,0; P$9 3.2,0; P$10 3.6,0; P$11 0,-2.19; P$12 0.4,-2.19; P$13 0.8,-2.19; P$14 1.2,-2.19; P$15 1.6,-2.19; P$16 2,-2.19; P$17 2.4,-2.19; P$18 2.8,-2.19; P$19 3.2,-2.19; P$20 3.6,-2.19
VFQFPN36 = smd 5.6 x 5.6: GND 0,0 | smd 0.55 x 0.3: PA0 -3.375,-0.775; PA1 -3.375,-1.275; PA2 -3.375,-1.775; PA3 -3.375,-2.275; PA4 -3.375,-2.775; PA8 3.375,-0.25; PA9 3.375,0.25; PA10 3.375,0.75; PA11 3.375,1.25; PA12 3.375,1.75; PA13 3.375,2.75; PB12 3.375,-2.75; PB13 3.375,-2.25; PB14 3.375,-1.75; PB15 3.375,-1.25; PC6 3.375,-0.75; PC13 -3.375,2.225; PC14 -3.375,1.725; PC15 -3.375,1.225; PF0 -3.375,0.725; PF1 -3.375,0.225; PG10 -3.375,-0.275; VBAT -3.375,2.725; VDD2 3.375,2.25 | smd 0.3 x 0.55: PA5 -2.75,-3.375; PA6 -2.25,-3.375; PA7 -1.75,-3.375; PA14 2.75,3.375; PA15 2.25,3.375; PB0 -0.75,-3.375; PB1 -0.25,-3.375; PB2 0.25,-3.375; PB3 0.75,3.375; PB4 0.25,3.375; PB5 -0.25,3.375; PB6 -0.75,3.375; PB7 -1.25,3.375; PB8 -1.75,3.375; PB9 -2.25,3.375; PB10 1.75,-3.375; PB11 2.75,-3.375; PC4 -1.25,-3.375; PC10 1.75,3.375; PC11 1.25,3.375; VDD1 -2.75,3.375; VDD3 2.25,-3.375; VDDA 1.25,-3.375; VREF+ 0.75,-3.375
S-PQFP-G48 = smd 0.229 x 1.143: 1-EN_GATE 0,0; 2-INHA 0.5,0; 3-INLA 1,0; 4-INHB 1.5,0; 5-INLB 2,0; 6-INHC 2.5,0; 7-INLC 3,0; 8-NFAULT 3.5,0; 9-NSCS 4,0; 10-SDI 4.5,0; 11-SDO 5,0; 12-SCLK 5.5,0; 25-GL_C 5.5,8.5; 26-SL_C 5,8.5; 27-SH_C 4.5,8.5; 28_GH_C 4,8.5; 29-GH_B 3.5,8.5; 30-SH_B 3,8.5; 31-SL_B 2.5,8.5; 32-GL_B 2,8.5; 33-GL_A 1.5,8.5; 34-SL_A 1,8.5; 35-SH_A 0.5,8.5; 36-GH_A 0,8.5 | smd 1.143 x 0.229: 13-PWRGD 7,1.5; 14-GND1 7,2; 15-AVDD 7,2.5; 16-SO1 7,3; 17-SO2 7,3.5; 18-SO3 7,4; 19-SN3 7,4.5; 20-SP3 7,5; 21-SN2 7,5.5; 22-SP2 7,6; 23-SN1 7,6.5; 24-SP1 7,7; 37-VCP_LSD -1.5,7; 38-VCPH -1.5,6.5; 39-CP2H -1.5,6; 40-CP2L -1.5,5.5; 41-PVDD -1.5,5; 42-CP1L -1.5,4.5; 43-CP1H -1.5,4; 44-VDRAIN -1.5,3.5; 45-GND2 -1.5,3; 46-DVDD -1.5,2.5; 47-WAKE -1.5,2; 48-VREG -1.5,1.5 | smd 5.17 x 5.17: GND 2.75,4.25
REC = smd 0.45 x 0.6: PAD_1 -0.75,0; PAD_2 2.35,0; PAD_3 -0.75,-2.25; PAD_4 2.35,-2.25 | smd 0.55 x 0.6: POWER_1 0,0; POWER_2 1.6,0; POWER_3 0,-2.25; POWER_4 1.6,-2.25 | smd 0.24 x 0.6: SIGNAL_1 0.6,0; SIGNAL_2 1,0; SIGNAL_3 0.6,-2.25; SIGNAL_4 1,-2.25
SOT-23 = smd 0.55 x 1: 1 0,0; 2 0.95,0; 3 1.9,0; 4 1.9,2.7; 5 0.95,2.7; 6 0,2.7
SOT-23-3 = smd 0.508 x 1.016: 1 -0.941,-1.312; 2 0.986,-1.312; 3 -0.03,1.282
Q5B = smd 3.8 x 4.52: D -0.4,-0.635 | smd 0.686 x 0.71: G 3.51,1.27 | smd 0.686 x 3.25: S 3.51,-1.27
PLUG_20_0.4_5024302012 = smd 0.35 x 0.44: CASE_1 -0.95,-0.69; CASE_2 4.55,-0.69 | smd 0.22 x 0.66: P$1 0,0; P$2 0.4,0; P$3 0.8,0; P$4 1.2,0; P$5 1.6,0; P$6 2,0; P$7 2.4,0; P$8 2.8,0; P$9 3.2,0; P$10 3.6,0; P$11 0,-1.38; P$12 0.4,-1.38; P$13 0.8,-1.38; P$14 1.2,-1.38; P$15 1.6,-1.38; P$16 2,-1.38; P$17 2.4,-1.38; P$18 2.8,-1.38; P$19 3.2,-1.38; P$20 3.6,-1.38

### Placement (x,y rotation side)
0001  6.26,15.96 180 top
0002  6.26,16.74 0 top
0003  33.5,0.92 0 top
0004  33.55,1.73 180 top
0005  36.96,-0.61 0 top
0006  36.82,0.79 0 top
0007  43.46,-5.14 270 top  (outside the outline)
0008  44.96,-5.04 90 top  (outside the outline)
0009  43.69,-2.62 270 top
0010  45,-2.48 90 top
0014  6.92,31.86 270 bottom
0015  18.94,31.86 270 bottom
0016  7.71,16.39 90 top
0017  6.99,14.54 270 top
0018  10.95,20.31 90 top
0019  11.73,20.31 270 top
0020  10.16,20.31 90 top
0021  9.37,20.31 90 top
C1  18.21,13.63 270 top
C2  8.99,13.46 90 top
C3  13.67,20.03 0 top
C4  44.2,16.56 270 top
C5  16.46,19.43 0 top
C6  6.26,17.44 180 top
C7  44.72,13.49 90 top
C8  32.69,16.48 90 top
C9  43.24,23.1 0 top
C10  49.24,10.17 270 top
C11  45.81,13.49 270 top
C12  31.55,13.59 90 top
C13  19.78,16.01 270 bottom
C14  19.78,19.22 90 bottom
C15  32.87,13.57 270 top
C16  45.57,16.59 90 top
C17  18.05,-37.08 90 top  (outside the outline)
C18  36.86,2.04 180 top
C19  46.44,-4.85 270 top  (outside the outline)
C20  33.55,2.59 0 top
C21  3.39,-26.16 0 top  (outside the outline)
C22  46.3,-2.19 270 top
C23  45.67,21.36 0 top
C24  26.63,-37.72 90 top  (outside the outline)
C25  -7.9,-37.95 90 top  (outside the outline)
C26  2.91,-37.48 90 top  (outside the outline)
C27  61.46,27.36 0 top
C28  61.39,25.68 0 top
C29  16.46,20.13 0 top
C30  6.16,15.68 270 bottom
C31  17.88,17.7 0 bottom
C32  17.88,18.74 0 bottom
C33  6.16,20.09 90 bottom
C34  7.5,13.68 270 bottom
C35  19.11,13.63 270 top
C36  17.98,15.85 90 bottom
C37  9.68,13.46 90 top
C38  18.14,20.47 180 bottom
C39  16.13,13.12 180 bottom
C40  13.67,20.73 0 top
C41  17.9,23.11 90 bottom
C42  8.03,20.94 0 bottom
C43  19.7,23.11 90 bottom
C44  8.03,21.78 180 bottom
C45  12.43,20.31 90 top
C46  8.95,22.58 90 top
C47  8.14,15.14 180 top
C49  8.95,24.27 90 top
LED9  7.4,13.25 0 top
M_A  7.42,39.27 0 bottom
M_B  12.93,39.27 180 bottom
MOTOR_PAD_C  18.44,39.27 0 bottom
R1  18.82,13.77 0 bottom
R2  61.52,29.17 0 top
R3  48.98,21.01 90 top
R4  61.52,24.27 0 top
R13  19.28,17.22 0 top
R16  15.36,20.83 180 top
R24  6.2,14.54 270 top
U2  13.43,16.01 270 top
U$1  14.73,24.77 0 bottom
U$12  49.24,27.48 0 top
U$13  41.35,17.64 180 top
U$14  35.56,7.45 0 top
U$15  41.68,5.21 180 top
U$16  36.45,-5.99 0 top  (outside the outline)
U$17  22.94,-37.43 0 top  (outside the outline)
U$18  31.33,17.3 270 bottom
U$19  31.33,12.83 270 bottom
U$20  -1.92,-37.43 0 top  (outside the outline)
U$21  14.92,13.18 0 bottom
U$22  13.57,38.46 270 top
U$23  13.56,32 270 top
U$24  8.36,38.46 270 top
U$25  8.36,32 270 top
U$26  18.78,38.46 270 top
U$27  34.78,30.6 0 top
U$28  18.77,32 270 top
U$29  46.08,0.83 180 top
U$30  14.73,30.67 0 bottom
U$31  5.95,22.85 90 bottom
U$32  14.73,22.36 180 top

### Tracks (layer width: path | path; a pad name or v marks a point on that pad's centre or on a via)
+3V3  (via drill 0.2)  (2 unrouted)
  Top 0.089: U2.27 v15.54,13.12 | 15.95,19.43 C5.1 C29.1 15.86,20.23 R16.1
  Top 0.152: C35.1 C1.1 17.8,13.73 v17.44,13.73 | R16.1 15.94,20.75 v15.94,20.61 | U2.1 15.95,19.43 | C2.1 C37.1 | C2.1 9.55,12.39 9.55,12.13 9.78,11.9 10.65,11.9 10.88,12.13 10.88,12.56 U2.19 | v8.08,12.54 8.23,12.69 8.62,12.69 8.88,12.96 C2.1
  Route2 0.152: v15.94,20.61 15.46,20.14 15.46,19.71 15.24,19.48 14.91,19.48 14.69,19.7 10.3,19.7 | U$31.5 8.93,23.52 8.93,21.62 8.63,21.33 8.37,21.33 8.14,21.1 8.14,20.77 8.42,20.49 9.51,20.49 10.3,19.7 | 10.3,19.7 9.84,19.24 9.84,15.53 9.56,15.25 9.56,13.78 10.88,12.46 10.88,12.13 10.65,11.9 9.78,11.9 9.14,12.54 v8.08,12.54
  Route15 0.152: v8.08,12.54 8.29,12.54 9.26,13.51 12.59,13.51 12.98,13.12 v15.54,13.12
  Bottom 0.089: v15.54,13.12 C39.1
  Bottom 0.152: U$21.48-VREG 17.06,14.68 17.15,14.6 17.31,14.6 17.96,13.94 R1.2 | v15.54,13.12 15.67,13.12 16.36,13.81 17.31,13.81 17.39,13.73 v17.44,13.73
  other vias: 8.65,23.8
+3V3_  (9 unrouted)
+5V_  (1 unrouted)
ADC_CA  (via drill 0.2)
  Top 0.089: U2.15 10.54,15.53 10.84,15.53 11.16,15.84 11.16,16.18 11.08,16.26 9.97,16.26 9.37,15.66 8.95,15.66 8.73,15.87 v8.37,16.23
  Bottom 0.089: 8.2,16.18 U$21.16-SO1 7.97,16.23 v8.37,16.23
ADC_CC  (via drill 0.2)
  Top 0.089: U2.16 10.84,15.02 11.34,15.52 11.34,16.51 11.08,16.76 9.7,16.76 9.31,16.38 8.74,16.38 8.41,16.71 8.41,17.13 v8.4,17.14
  Bottom 0.089: U$21.18-SO3 8.36,17.18 v8.4,17.14
ADC_VA  (via drill 0.2)
  Top 0.089: U2.7 C45.1 0019.2 11.09,19.81 | 11.09,19.81 0018.1 | 11.09,19.81 10.66,19.37 9.78,19.37 9.28,19.37 v9.09,19.19
  Route2 0.089: U$31.1 5.95,21.97 7.35,20.57 7.72,20.57 v9.09,19.19
  other vias: 5.95,22.85
ADC_VB  (via drill 0.2)
  Top 0.089: U2.8 11.93,18.61 11.6,18.28 9.43,18.28 9.42,18.29 9.12,18.29 9.12,18.28 8.95,18.28 8.44,18.8 8.44,20.33 8.91,20.81 0021.2 | 0021.2 9.68,20.5 9.68,20.45 10.16,19.97 0020.1 | 9.37,20.65 0021.2 | 0021.2 8.95,21.23 C46.1 8.49,22.08 8.43,22.14 8.14,22.14 v7.83,22.45
  Route2 0.089: v7.83,22.45 5.95,24.33 U$31.3
  other vias: 5.95,24.75
ADC_VC  (via drill 0.2)
  Top 0.089: 0016.1 7.9,15.89 C47.1 8.27,14.77 v8.27,14.25 7.2,14.25 0017.2 | v9.27,17.93 9.36,18.02 U2.10
  Route2 0.089: v8.27,14.25 9.63,15.62 9.63,17.3 9.27,17.66 v9.27,17.93
  Bottom 0.089: U$31.4 9.19,24.21 9.21,24.21 9.28,24.13 9.28,22.42 9.18,22.31 9.18,21.06 9.45,20.78 9.45,18.1 v9.28,17.93 v9.27,17.93
ADC_VMOT  (via drill 0.2)
  Top 0.089: U2.11 8.26,17.51 8.07,17.32 7.77,17.32 7.33,17.76 | 7.33,17.76 7.33,20.59 7.14,20.78 7.14,22.26 7.69,22.81 8.24,22.81 v8.29,22.85 | C6.1 6.79,17.44 | 6.79,17.44 7.01,17.44 7.33,17.76 | 6.79,17.44 6.79,16.78 0002.2 0001.1
  Bottom 0.089: v8.29,22.85 U$31.6 8.68,22.82
CAN_RX  (via drill 0.2)
  Top 0.089: U2.23 13.18,13.37 13.18,13.67 12.82,14.03 11.45,14.03 11.35,13.93 11.25,13.93 10.17,12.84 10.17,12.6 9.94,12.37 v9.94,12.29
  Route2 0.089: v9.94,12.29 8.83,13.4 8.83,13.52 8.46,13.89 8.12,13.89 7.91,14.1 7.91,14.4 8.73,15.23 8.73,16.38 8.36,16.75 8.28,16.75 8.02,17.02 8.02,17.27 8.28,17.53 8.28,17.83 8.74,18.29 9.24,18.29 9.45,18.5 9.45,19.34 9.24,19.55 9.07,19.55 7.93,20.69 7.93,21.93 8.71,22.72 8.71,23.22 8.29,23.65 8.29,23.95 8.5,24.16 9.49,24.16 v9.71,24.37
  Bottom 0.089: U$1.P$10 11.13,24.43 10.91,24.22 | 10.91,24.22 10.88,24.19 | 10.91,24.22 10.88,24.22 10.86,24.19 9.89,24.19 v9.71,24.37
CAN_TX  (via drill 0.2)
  Top 0.089: U2.24 14.18,13.37 14.18,13.67 14.44,13.93 15.42,13.93 15.97,13.38 v15.97,12.27
  Route2 0.089: v18.2,19.83 18.2,17.32 18.07,17.19 18.07,15.24 17.4,14.56 17,14.56 16.79,14.35 16.79,13.79 16.27,13.27 16.27,12.57 v15.97,12.27
  Route15 0.089: v9.75,23.83 9.13,23.21 8.09,23.21 6.61,21.73 6.61,20.2 6.82,19.99 7.38,19.99 8.73,18.64 8.73,18.5 8.95,18.29 9.24,18.29 9.45,18.5 9.45,18.64 10.08,19.27 17.64,19.27 v18.2,19.83
  Bottom 0.089: U$1.P$9 11.53,24.58 10.78,23.83 v9.75,23.83
ENGATE  (via drill 0.2)
  Top 0.089: U2.2 14.93,19.73 v15.07,19.87
  Route2 0.089: 15.07,12.42 15.07,12.12 15.28,11.91 16.12,11.91 17.08,12.87 v17.45,12.87 | 15.07,12.42 | 15.07,12.42 15.07,19.02 16.3,20.24 16.3,20.76 16.09,20.97 15.79,20.97 15.26,20.44 15.26,20.05 v15.07,19.87
  Bottom 0.089: 14.92,13.56 U$21.1-EN_GATE 15,13.11 15,12.19 15.28,11.91 16.21,11.91 16.84,12.54 17.11,12.54 v17.45,12.87
GH_A  (via drill 0.2, 0.2 pad 0.45)  (1 unrouted)
  Top 0.152: v14.94,21.49 14.94,21.98 15.12,22.17 15.12,23.3 14.89,23.53 13.91,23.53 13.53,23.15 U$32.P$4 | v15.46,26.17 13.08,26.17 12.45,26.8 9.55,26.8 v9.4,26.95
  Route2 0.152: v14.94,21.49 14.94,22.79 15.6,23.45 15.6,26.03 v15.46,26.17 | 9.06,27.42 9.06,27.28 v9.4,26.95
  Route2 0.203: v12.33,30.18 12.33,31.2 12.34,31.21 12.34,31.56 12.1,31.81 10.55,31.81 9.06,30.32 9.06,27.42
  Route15 0.203: U$24.G 12.34,32.24 12.34,31.21 | v12.33,30.18 v12.32,30.18 12.32,31.2
  Bottom 0.152: U$21.36-GH_A 14.94,21.67 v14.94,21.49
  Bottom 0.203: v12.33,30.18 U$30.P$7
  other vias: 9.63,34.95
GH_A_  (1 unrouted)
GH_B  (via drill 0.2, 0.2 pad 0.45)
  Top 0.152: U$32.P$5 | U$32.P$5 v13.13,23.5
  Top 0.203: 15.53,33.09 v15.54,33.08 15.54,34.25 U$22.G
  Route2 0.152: v11.42,21.69 11.53,21.59 11.53,21.26 11.78,21.01 13.1,21.01 13.33,21.24 13.33,21.56 13.13,21.76 v13.13,23.5 13.13,24.61 13.52,25 13.52,25.38 12.52,26.38 9.41,26.38 8.77,27.02 8.77,27.3
  Route2 0.203: v15.54,33.08 11.41,33.08 8.77,30.44 8.77,27.3
  Bottom 0.152: U$21.29-GH_B v11.42,21.69
  Bottom 0.203: U$30.P$6 12.73,31.03 14.78,33.08 v15.54,33.08
GH_B_  (1 unrouted)
GH_C  (via drill 0.2, 0.2 pad 0.45)
  Top 0.152: U$32.P$8 v11.93,23.14 11.93,23.66 11.69,23.9 11.34,23.9 10.74,23.3 10.74,22.17 10.92,21.99 v10.92,21.42
  Top 0.203: v20.85,34.03 20.59,34.3 20.59,34.38 20.05,34.92 U$26.G
  Route2 0.152: v11.93,23.14 11.93,24.61 11.54,25 11.54,25.86 v11.4,25.99 | v15.21,27.15 15.23,27.18 15.23,27.6
  Route2 0.203: 15.23,27.6 15.23,28.63 15.57,28.97 15.57,29.32 15.5,29.38 v15.5,30.72 17.85,30.72 20.5,33.37 20.5,33.68 v20.85,34.03
  Bottom 0.152: U$21.28_GH_C v10.92,21.42 | v11.4,25.99 11.55,26.14 11.55,26.16 11.82,26.42 12.04,26.42 13.07,27.46 14.89,27.46 v15.21,27.15
  Bottom 0.203: U$30.P$3 13.93,30.99 13.94,30.99 14.14,31.19 15.04,31.19 v15.5,30.72
GH_C_  (1 unrouted)
GL_A  (via drill 0.2, 0.2 pad 0.45)
  Top 0.152: U$32.P$11 15.13,24.95 15.91,24.95 16.16,24.7 v16.16,24.43 | v16,26.31 15.88,26.31 15.51,26.68 12.91,26.68 12.55,27.04 10.11,27.04 9.63,27.52
  Top 0.203: 9.63,27.52 U$25.G 9.63,29.04 10,29.42 10.81,29.42 10.92,29.3 10.92,29.27 v11.05,29.15
  Route2 0.152: v15.8,21.51 15.8,23.31 15.84,23.35 15.84,24.12 v16.16,24.43 16.16,26.16 v16,26.31
  Bottom 0.089: U$30.P$20 11.1,29.29
  Bottom 0.152: U$21.33-GL_A 13.42,21.35 13.42,21.27 13.74,20.95 15.23,20.95 v15.8,21.51
  Bottom 0.203: v11.05,29.15 11.05,29.24 11.1,29.29
GL_A_  (1 unrouted)
GL_B  (via drill 0.2, 0.2 pad 0.45)
  Top 0.152: U$32.P$20 v10.71,24.55 | v10.71,24.55
  Top 0.203: v14.52,28.4 14.61,28.49 U$23.G
  Route2 0.152: v12.94,21.4 12.82,21.52 12.82,21.85 11.92,22.74 10.97,22.74 10.71,23.01 10.71,24.18 | 10.71,24.18 v10.71,24.55 9.78,25.48 v9.78,25.99 | 10.71,24.18
  Route15 0.152: v9.78,25.99 9.93,26.14 9.93,26.16 10.4,26.63 13.79,26.63 14.52,27.36
  Route15 0.203: 14.52,27.36 v14.52,28.4
  Bottom 0.152: U$21.32-GL_B 12.92,21.41 v12.94,21.4
  Bottom 0.203: U$30.P$11 14.73,28.61 v14.52,28.4
GL_B_  (1 unrouted)
GL_C  (via drill 0.2, 0.2 pad 0.45)
  Top 0.152: U$32.P$9 v11.53,23.51
  Top 0.203: v14.33,30.18 14.45,30.31 19.92,30.31 20.04,30.19 U$28.G
  Route2 0.152: v11.53,23.51 11.53,24.67 11.3,24.9 11.3,25.54 11.01,25.83 11.01,25.84 v10.86,25.99
  Route15 0.152: 14.81,27.55 14.81,27.15 13.93,26.26 12.23,26.26 12.11,26.38 11.24,26.38 11.01,26.16 11.01,26.14 v10.86,25.99
  Route15 0.203: 14.81,27.55 14.81,28.11 14.94,28.23 14.94,28.77 14.73,28.97 14.73,29.77 v14.33,30.18
  Bottom 0.152: U$21.25-GL_C 9.42,21.95 9.56,22.08 9.56,23.11 9.85,23.4 10.84,23.4 10.97,23.53 11.29,23.53 11.31,23.51 v11.53,23.51
  Bottom 0.203: U$30.P$2 v14.33,30.18
GL_C_  (1 unrouted)
GND  (via drill 0.2, 0.4, 1)  (16 unrouted)
  Top 0.089: C29.2 C5.2
  Top 0.152: U2.26 14.93,12.2 15.25,11.88 16.13,11.88 16.37,12.11 16.37,12.4 16.63,12.66 C39.2 17.14,13.12 17.28,13.26 18.08,13.26 C1.2 | C1.2 C35.2 19.36,13.38 19.93,13.38 20.16,13.61 20.16,15.9 19.46,16.6 19.46,17.84 19.7,18.07 C43.2 | U$32.P$18 U$32.P$19 11.53,24.73 11.31,24.95 10.55,24.95 10.19,24.58 U$32.CASE_22 9.87,24.76 C49.2 | U$32.P$18 U$32.P$17 U$32.P$16 U$32.P$15 | U$32.P$15 U$32.P$14 | U$32.P$18 v11.93,25.17 | U$32.P$15 v13.13,25.17 | U2.5 13.43,19.29 C3.2 v14.17,20.44 C40.2 | C5.2 16.96,18.64 U2.36 U2.35 | 0019.1 C45.2 v12.43,20.61 | v7.83,24.77 C49.2 | C46.2 8.73,23.3 8.54,23.3 8.26,23.58 8.26,24.06 C49.2 | U2.18 9.74,14.01 C37.2 C2.2 8.88,13.85 7.71,13.85 7.21,13.35 7.21,12.78 7.12,12.69 6.18,12.69 5.69,13.18 5.69,14.41 6.2,14.92 R24.1 0017.1 7.54,15.04 C47.2 | v17.99,12.91 C1.2 | 0002.1 C6.2 5.76,19.12 4.55,20.33 v4.42,20.33 | C29.2 17.94,20.13 18.04,20.22 18.4,20.22 v18.66,20.48 | v21.44,25.36 v21.44,28.08 | v4.42,25.36 v4.42,28.08 | 9.35,19.81 v9.05,20.1
  Route2 0.152: R24.1 5.34,15.91 5.34,18.89 4.42,19.8 v4.42,20.33
  Bottom 0.089: U$1.P$8 v11.93,25.17 | U$1.P$5 v13.13,25.17 | C47.2 7.68,15.18 U$21.14-GND1
  Bottom 0.152: U$21.45-GND2 17.12,16.18 17.14,16.16 17.79,16.16 C36.2 18.5,16.35 C13.2 19.2,14.49 19.1,14.49 18.63,14.02 18.63,13.15 18.53,13.06 18.14,13.06 v17.99,12.91 | C41.2 C43.2 21.38,24.51 21.44,24.56 | v12.43,20.61 12.43,17.69 U$21.GND | U$21.GND 14.17,19.43 v14.17,20.44 | v4.42,21.58 6.06,21.58 C33.2 | v4.42,22.84 4.4,22.86 4.4,23.57 4.63,23.8 U$31.2 6.46,24.31 6.52,24.31 6.98,24.77 v7.83,24.77 | C34.2 6.39,14.28 C30.2 6.16,15 R24.1 | U$21.GND 9.67,17.43 9.57,17.54 9.11,17.54 8.88,17.77 8.88,18.14 8.34,18.68 U$21.21-SN2 U$21.22-SP2 8.34,19.18 8.9,19.74 8.9,19.94 v9.05,20.1 | C38.2 v18.66,20.48
  other vias: 4.42,31.85 4.42,30.59 4.42,29.34 21.44,31.85 21.44,30.59 21.44,29.34 10.41,28.37 21.44,33.11 4.42,33.11 10.41,28.9 10.94,28.37 11.47,28.37 12.01,28.37 12.54,28.37 13.07,28.37 13.61,28.37 12.17,28.9 12.17,29.43 12.71,28.9 13.24,28.9 13.77,28.9 12.71,29.43 13.24,29.43 13.77,29.43 16.63,13.12 21.44,21.58 21.44,22.84 21.44,24.1 4.42,24.1 21.44,20.33 7.64,15.14 6.2,15.04 19.7,24.51
  pour Bottom (rank 2, no thermals): 4.42,28.08 4.42,35.52 21.44,35.52 21.44,28.08
  pour Route2 (no thermals): 4.42,35.52 21.44,35.52 21.44,28.08 4.42,28.08
  pour Route15 (no thermals): 4.42,35.52 21.44,35.52 21.44,28.08 4.42,28.08
  pour Top (rank 3, no thermals): 4.42,28.08 4.42,30.45 21.44,30.45 21.44,28.08
GND1  (via drill 1)  (4 unrouted)
  other vias: 47.16,8.99 47.16,7.73 47.16,6.48 47.16,5.22 47.16,10.25
GND2  (via drill 1)  (4 unrouted)
  other vias: 30.14,8.99 30.14,7.73 30.14,6.48 30.14,5.22 30.14,10.25
GND_  (43 unrouted)
GND_A  (via drill 0.2, 0.2 pad 0.45)  (1 unrouted)
  Top 0.152: U$32.P$1 v14.73,23.13
  Route2 0.152: v14.73,23.13 14.27,23.6 14.27,25.66 12.82,27.11 10.55,27.11 9.89,27.77
  Route2 0.203: v11.13,30.18 10.95,30.18 10.88,30.25 10.53,30.25 9.89,29.61 9.89,27.77
  Route15 0.152: v7.5,20.93 7.96,21.39 8.7,21.39 10.05,22.74 13.13,22.74 13.91,23.53 14.24,23.53 14.63,23.13 v14.73,23.13
  Route15 0.203: v11.13,30.18 11.13,32.31 9.42,34.02 v4.98,34.02
  Bottom 0.152: v7.5,20.93 7.5,20.6 U$21.24-SP1
  Bottom 0.203: U$30.P$10 v11.13,30.18 | v4.98,34.02 5.84,34.88 6.8,34.88
GND_C  (via drill 0.2, 0.2 pad 0.45)  (1 unrouted)
  Top 0.152: U$32.P$7 v12.33,23.51 | v8.29,21.78 8.29,21.24 8.14,21.1 v8.14,18.25
  Route2 0.152: v12.33,23.51 v12.32,23.52 12.32,25.47 12.1,25.7 12.1,25.84 v11.95,25.99 | v13.63,27.07 14.27,27.07 14.94,27.73
  Route2 0.203: v15.55,31.27 15.43,31.14 15.33,31.14 15.09,30.9 15.09,29.67 14.73,29.32 14.73,28.78 14.94,28.58 14.94,27.73
  Route15 0.152: v12.33,23.51 12.12,23.51 11.73,23.9 10.4,23.9 v8.29,21.78
  Route15 0.203: 21.44,33.12 19.67,33.12 17.82,31.27 16.56,31.27 16.27,31.56 15.92,31.56 15.63,31.27 v15.55,31.27
  Bottom 0.152: 7.93,18.19 U$21.20-SP3 8.07,18.18 v8.14,18.25 | v11.95,25.99 13.02,27.07 v13.63,27.07
  Bottom 0.203: U$30.P$4 13.53,31.01 14,31.48 15.34,31.48 v15.55,31.27
I2C_SCL  (via drill 0.2)
  Top 0.089: U2.33 15.98,16.52 15.41,17.08 15.41,17.92 15.18,18.15 15.18,19.47 15.43,19.72 15.43,20.02 15.36,20.09 v15.36,21.85
  Bottom 0.089: U$1.P$7 12.33,24.26 12.48,24.11 13.38,24.11 13.99,23.5 14.88,23.5 15.36,23.02 v15.36,21.85
I2C_SDA  (via drill 0.2)
  Top 0.089: U2.34 16.03,17.02 15.59,17.45 15.59,18.07 16.39,18.88 16.39,21.69 16.29,21.79 v16.19,21.89
  Bottom 0.089: U$1.P$6 12.73,24.41 12.86,24.29 13.45,24.29 14.06,23.67 14.96,23.67 15.5,23.13 15.9,23.13 15.97,23.05 15.97,22.11 v16.19,21.89
INPUT  (via drill 0.2)
  Top 0.089: v9.09,18.65 9.36,18.91 U2.9
  Route15 0.089: 12.79,20.46 | 12.79,20.46 13.12,20.8 14.17,20.8 14.51,21.13 15.95,21.13 16.55,21.74 16.55,22.04 16.34,22.25 v16.34,22.43 | 12.79,20.46 12.52,20.19 9.73,20.19 9.09,19.55 8.95,19.55 8.73,19.34 8.73,19.01 v9.09,18.65
  Bottom 0.089: U$1.P$4 13.53,24.46 14.14,23.85 15.03,23.85 15.57,23.31 15.97,23.31 16.34,22.94 v16.34,22.43
LED  (via drill 0.2)
  Top 0.089: U2.22 12.78,13.26 12.78,13.5 12.53,13.75 11.33,13.75 10.48,12.9 v10.48,12.29 | LED9.A 8.35,13.46 v8.39,13.46
  Bottom 0.089: v10.48,12.29 10.45,12.29 10.09,11.93 9.79,11.93 9.18,12.55 9.18,12.67 v8.39,13.46
N$1  (via drill 1)  (2 unrouted)
  other vias: 31.88,19.61 33.13,19.61 34.39,19.61
N$2  (via drill 0.2)
  Top 0.152: U2.6 12.93,19.26 13.17,19.5 C3.1 v13.17,20.33 C40.1
  Route2 0.152: v19.77,13.77 19.77,18.74 | 19.77,18.74 | 19.77,18.74 18.87,19.65 v18.71,19.65
  Route15 0.152: v13.17,20.33 13.72,20.33 14.57,19.48 17.29,19.48 18.04,20.22 18.36,20.22 18.71,19.87 v18.71,19.65
  Bottom 0.152: v19.77,13.77 R1.1
N$6  (via drill 1)  (2 unrouted)
  other vias: 37.39,19.61 38.65,19.61 39.9,19.61
N$10
  Bottom 0.152: U$21.46-DVDD 16.91,15.68 17.15,15.92 17.47,15.92 17.98,15.42 C36.1
N$12
  Bottom 0.089: U$21.15-AVDD 7.54,15.67 7.22,15.35 7.22,14.51 7.5,14.23 C34.1
N$13
  Bottom 0.152: C38.1 17.36,20.18 U$21.37-VCP_LSD
N$14
  Bottom 0.152: C31.2 17.36,17.68 U$21.42-CP1L
N$16
  Bottom 0.152: U$21.43-CP1H 17.04,17.18 17.05,17.19 17.87,17.19 C31.1
N$20
  Bottom 0.152: C32.2 17.32,18.68 U$21.40-CP2L
N$21
  Bottom 0.152: U$21.39-CP2H 16.94,19.18 17.01,19.25 17.87,19.25 C32.1
N$22  (via drill 0.2)
  Top 0.152: v18.43,17.04 R13.1
  Bottom 0.152: U$21.44-VDRAIN 16.88,16.68 17.15,16.95 17.47,16.95 17.61,16.82 18.2,16.82 v18.43,17.04
N$23
  Bottom 0.152: U$21.38-VCPH 17.03,19.68 17.22,19.5 17.97,19.5 18.21,19.25 18.88,19.25 19.11,19.48 19.11,19.49 C14.2
N$29  (via drill 1)  (2 unrouted)
  other vias: 42.9,19.61 44.16,19.61 45.42,19.61
N$30  (1 unrouted)
N$31  (1 unrouted)
N$32  (1 unrouted)
N$33
  Top 0.089: U$13.42-CP1L 43.44,13.14 43.91,13.61 43.91,15.42 C4.2
N$34  (1 unrouted)
N$35
  Top 0.089: U$13.40-CP2L 43.97,12.14 44.08,12.26 44.08,13.24 44.72,13.88 C7.2
N$36
  Top 0.089: C7.1 43.72,11.64 U$13.39-CP2H
N$38  (1 unrouted)
N$39
  Top 0.089: C11.2 45.81,12.49 44.46,11.14 U$13.38-VCPH
N$40  (1 unrouted)
N$41  (1 unrouted)
N$48  (2 unrouted)
N$81
  Top 0.089: LED9.C 6.2,13.7 R24.2
NFAULT  (via drill 0.2)
  Top 0.089: U2.3 14.43,18.61 13.92,18.1 11.42,18.1 11.16,17.84 11.16,17.34 11.08,17.27 10.75,17.27 10.75,17.26 9.97,17.26 9.86,17.15 9.53,17.15 9.52,17.14 v9.26,17.14
  Bottom 0.089: U$21.8-NFAULT 11.42,14 11.62,14.21 11.62,14.51 11.42,14.71 9.53,14.71 9.45,14.79 9.45,16.96 9.28,17.14 v9.26,17.14
NRST  (via drill 0.2)
  Top 0.089: R16.2 v14.86,20.55 14.86,20.17 14.71,20.02 14.71,19.74 14.53,19.55 14.26,19.55 13.93,19.22 U2.4
  Bottom 0.089: U$1.P$3 13.93,24.31 14.21,24.03 15.1,24.03 15.64,23.48 16.05,23.48 16.51,23.02 16.51,22.76 16.7,22.58 16.7,21.88 15.55,20.74 15.04,20.74 v14.86,20.55
PWM_AH  (via drill 0.2)
  Top 0.089: U2.29 16.89,14.51 17.15,14.26 v17.15,14.2
  Bottom 0.089: U$21.2-INHA 14.42,14.04 14.57,14.18 15.03,14.18 15.23,14.38 16.47,14.38 16.64,14.2 v17.15,14.2
PWM_AL  (via drill 0.2)
  Top 0.089: U2.30 17.28,15.01 v17.31,14.99
  Bottom 0.089: U$21.3-INLA 13.92,14.19 14.09,14.36 14.96,14.36 15.53,14.93 17.25,14.93 v17.31,14.99
PWM_BH  (via drill 0.2)
  Top 0.089: U2.31 17.29,15.51 v17.31,15.53
  Bottom 0.089: U$21.4-INHB 13.42,14.22 13.74,14.54 14.89,14.54 15.78,15.43 17.21,15.43 v17.31,15.53
PWM_BL  (via drill 0.2)
  Top 0.089: v17.31,16.56 16.77,16.02 U2.32
  Bottom 0.089: U$21.5-INLB 12.92,14.23 13.4,14.71 14.81,14.71 15.72,15.62 15.72,16.35 15.8,16.43 17.18,16.43 v17.31,16.56
PWM_CH  (via drill 0.2)  (1 unrouted)
  Bottom 0.089: v12.42,13.12 U$21.6-INHC
PWM_CL  (via drill 0.2)  (1 unrouted)
  Bottom 0.089: U$21.7-INLC v11.92,12.84
SH_A  (via drill 0.2, 0.2 pad 0.45, 0.4, 1)
  Top 0.089: 0018.2 v10.95,20.55
  Top 0.152: U$32.P$2 14.42,22.27 U$21.35-SH_A
  Top 0.203: U$25.D 9.1,31.02 v10.35,31.02
  Route2 0.152: U$21.35-SH_A 13.54,22.57 13.54,24.68 13.76,24.9 13.76,25.48 12.62,26.63 10.28,26.63 9.36,27.54
  Route2 0.203: v10.35,31.02 9.36,30.02 9.36,27.54
  Route15 0.152: v10.95,20.55 11.18,20.79 11.41,20.79 11.63,21.01 14.09,21.01 14.42,21.34 U$21.35-SH_A
  Bottom 0.203: U$30.P$9 11.53,31.15 11.47,31.2 10.95,31.2 10.67,30.92 10.45,30.92 v10.35,31.02
  other vias: 5.59,36.54 6.16,41.81 7.42,41.81 8.67,41.81 5.59,36 6.12,36.54 6.12,36 6.65,36.54 6.65,36 7.19,36.54 7.19,36 7.72,36.54 8.26,36.54 8.79,36.54 9.32,36.54 7.72,36 8.26,36 8.79,36 9.32,36 9.86,36.54 9.86,36 14.42,21.68
  pour Bottom (no thermals): 5.3,35.74 5.3,41.81 10.16,41.81 10.16,35.74
  pour Top (rank 2, no thermals): 10.16,30.45 10.16,36.91 5.3,36.91 5.3,30.45
SH_A1  (via drill 1)  (2 unrouted)
  other vias: 19.7,11.63 18.44,11.63 17.18,11.63
SH_A_  (2 unrouted)
SH_B  (via drill 0.2, 0.2 pad 0.45, 0.4, 1)
  Top 0.089: 0020.2 v10.16,20.76
  Top 0.152: U$32.P$3 13.93,22.99 v14.07,23.13
  Route2 0.152: v11.92,31.39 11.11,30.57 10.48,30.57 9.62,29.72 9.62,27.66 10.41,26.87 12.72,26.87 14.01,25.58 14.01,23.2 v14.07,23.13
  Route15 0.152: v14.07,23.13 13.86,23.13 13.23,22.5 12.69,22.5 12.03,21.85 12.03,21.54 v11.92,21.42 11.71,21.42 11.31,21.03 10.43,21.03 v10.16,20.76
  Bottom 0.089: v10.16,20.76 10.16,20.94 10.17,20.95
  Bottom 0.152: v11.92,21.42 v11.92,21.43 U$21.30-SH_B | 14.05,23.13 v14.07,23.13
  Bottom 0.203: U$30.P$8 v11.93,31.39 v11.92,31.39
  other vias: 10.6,36.54 11.67,41.81 12.93,41.81 14.19,41.81 10.6,36 11.13,36.54 11.66,36.54 12.2,36.54 12.73,36.54 13.27,36.54 13.8,36.54 14.33,36.54 14.87,36.54 11.13,36 11.66,36 12.2,36 12.73,36 13.27,36 13.8,36 14.33,36 14.87,36
  pour Bottom (no thermals): 10.5,35.74 10.5,41.81 15.37,41.81 15.37,35.74
  pour Top (rank 2, no thermals): 15.36,30.45 15.36,36.91 10.5,36.91 10.5,30.45
SH_B1  (via drill 1)  (2 unrouted)
  other vias: 14.19,11.63 12.93,11.63 11.67,11.63
SH_B_  (2 unrouted)
SH_C  (via drill 0.2, 0.2 pad 0.45, 0.4, 1)
  Top 0.089: v6.97,20.35 6.97,18.49 6.33,17.85 6.33,15.55 6.41,15.47 7.12,15.47 7.19,15.55 7.19,16.38 0016.2
  Top 0.152: U$32.P$6 v12.73,23.13 12.72,23.14 12.72,23.67 12.25,24.14 11.15,24.14 9.86,22.85 9.86,22.07 9.95,21.97 10.14,21.97 v10.42,21.69
  Route2 0.152: v12.73,23.13 12.72,23.14 12.72,23.67 12.56,23.83 12.56,25.79 v12.49,25.86
  Route15 0.089: v10.42,21.69 10.24,21.51 10.24,21.43 9.89,21.08 9.53,21.08 8.78,20.33 7.25,20.33 7.23,20.35 v6.97,20.35
  Route15 0.152: v12.49,25.86 14.52,25.86 15.6,26.94 15.6,27.32 15.54,27.38 15.54,27.91
  Route15 0.203: 15.54,27.91 15.54,28.94 15.57,28.97 15.57,29.32 16.09,29.84 v16.09,31.14
  Bottom 0.152: U$21.27-SH_C v10.42,21.69
  Bottom 0.203: U$30.P$5 13.13,31.02 13.88,31.77 15.63,31.77 15.97,31.44 15.97,31.27 v16.09,31.14
  other vias: 20.27,36.54 17.18,41.81 18.44,41.81 19.7,41.81 19.74,36.54 20.27,36 19.74,36 19.2,36.54 18.67,36.54 18.14,36.54 17.6,36.54 17.07,36.54 16.54,36.54 16,36.54 19.2,36 18.67,36 18.14,36 17.6,36 17.07,36 16.54,36 16,36
  pour Bottom (no thermals): 15.71,35.74 15.71,41.81 20.57,41.81 20.57,35.74
  pour Top (no thermals): 20.57,30.45 20.57,36.91 15.71,36.91 15.71,30.45
SH_C1  (via drill 1)  (2 unrouted)
  other vias: 8.67,11.63 7.42,11.63 6.16,11.63
SH_C_  (2 unrouted)
SL_A  (via drill 0.2, 0.2 pad 0.45, 0.4)  (2 unrouted)
  Top 0.152: U$32.P$12 14.46,24.42 14.46,24.24 14.55,24.15 15.28,24.15 15.45,23.97 16.46,23.97 v16.59,24.1 | v17.09,26.23 17,26.23 16.55,25.78 13.13,25.78 12.35,26.56 9.23,26.56 9.01,26.79 9.01,27.52 9.06,27.57
  Top 0.203: 8.44,29.78 v8.26,29.96 | v10.71,29.83 10.58,29.71 9.88,29.71 9.6,29.43 | 9.08,29.43 9.6,29.43 | 9.08,29.43 v8.26,29.43 | 9.08,29.43 | 9.19,29.02 9.06,28.89 9.06,27.57 | 9.19,29.02 | 9.6,29.43 9.19,29.02
  Route2 0.152: v16.59,24.1 16.59,24.22 16.98,24.61 16.98,24.93 16.93,24.98 16.93,26.08 v17.09,26.23 | v13.93,21.4 13.56,21.04 13.56,20.17 13.33,19.94 12.11,19.94 11.11,20.95 10.53,20.95 10.29,21.18 8.83,21.18 8.73,21.09 8.68,21.09 C42.1
  Route2 0.203: v11.53,29.78 11.31,29.78 11.3,29.76 10.78,29.76 v10.71,29.83
  Route15 0.152: v13.93,21.4 14.03,21.5 14.03,21.84 14.26,22.07 14.57,22.07 v16.59,24.1
  Bottom 0.152: v13.93,21.4 U$21.34-SL_A 13.92,21.26 | C42.1 8.53,20.49 8.66,20.36 8.66,20 8.34,19.68 U$21.23-SN1
  other vias: 5.59,28.36 5.59,28.89 5.59,29.43 5.59,29.96 6.12,29.96 6.65,29.96 7.19,29.96 7.72,29.96 6.12,29.43 6.65,29.43 7.19,29.43 7.72,29.43 6.12,28.89 6.65,28.89 7.19,28.89 7.72,28.89 8.26,28.89 6.12,28.36 6.65,28.36 7.19,28.36 7.72,28.36 8.26,28.36 8.53,20.94
  pour Bottom (no thermals): 8.67,30.58 8.67,28.08 5.17,28.08 5.17,30.58
SL_A_  (3 unrouted)
SL_B  (via drill 0.2)  (1 unrouted)
  Top 0.152: U$32.P$13 13.93,24.37 14.39,23.9 15.18,23.9 15.37,23.71 16.25,23.71 16.75,23.71 16.98,23.94 16.98,24.26 16.59,24.65 v16.59,24.77 | v16.55,26.33 15.6,27.29 15.6,27.32 15.37,27.54 13.21,27.54 12.28,28.48 12.28,28.77
  Route2 0.152: v16.59,24.77 16.59,25.8 16.59,25.87 16.59,26.29 v16.55,26.33
  Route15 0.152: v16.59,24.77 16.38,24.77 16.32,24.83 15.99,24.83 15.77,24.6 15.77,23.61 14.89,22.74 13.81,22.74 13.33,22.26 13,22.26 U$21.31-SL_B
  other vias: 12.42,21.69
SL_B_  (1 unrouted)
SL_C  (via drill 0.2, 0.2 pad 0.45, 0.4)  (2 unrouted)
  Top 0.152: U$32.P$10 v11.13,23.13 | U$21.19-SN3 7.74,17.86 7.74,20.48 7.9,20.63 7.9,21.41 C44.1
  Route2 0.152: v11.13,23.13 11.13,24.73 11.06,24.8 11.06,25.34 10.8,25.6 10.7,25.6 10.47,25.83 10.47,25.84 v10.32,25.99
  Route15 0.152: v9.88,21.58 9.73,21.58 8.69,20.54 7.34,20.54 7.11,20.77 7.11,21.09 7.53,21.52 C44.1
  Bottom 0.152: v11.13,23.13 10.44,23.13 10.41,23.16 9.95,23.16 9.86,23.07 9.86,22.28 9.92,22.21 U$21.26-SL_C 9.92,21.62 v9.88,21.58 | v10.32,25.99 10.47,26.14 10.47,26.16 12.02,27.7 14.92,27.7 15.15,27.93
  Bottom 0.203: U$30.P$1 15.15,30.25 v15.15,29.15 | v15.15,29.15 16.79,29.15 16.87,29.07 | 15.15,27.93 v15.15,29.15
  other vias: 19.27,28.37 19.27,28.9 19.27,29.43 18.73,28.37 18.19,28.37 17.66,28.37 17.13,28.37 16.59,28.37 16.06,28.37 18.73,28.9 18.19,28.9 17.66,28.9 17.13,28.9 16.59,28.9 18.73,29.43 18.19,29.43 17.66,29.43 17.13,29.43 16.59,29.43 7.53,21.78 7.92,17.68
  pour Bottom (no thermals): 16.54,30.57 20.69,30.57 20.69,29.43 20.69,28.08 16.6,28.08 16.54,28.08
SL_C_  (3 unrouted)
SP_A_  (2 unrouted)
SP_C_  (2 unrouted)
SPI_CS  (via drill 0.2)
  Top 0.089: U2.17 11.1,14.51 v11.26,14.35
  Bottom 0.089: v11.26,14.35 10.92,14.01 U$21.9-NSCS
SPI_MISO  (via drill 0.2)
  Top 0.089: 10.21,16.5 10.51,16.5 U2.13 10.46,16.44 9.9,16.44 9.48,16.02 v9.09,16.02
  Bottom 0.089: 8.91,13.95 8.8,14.05 8.8,15.73 v9.09,16.02 | 8.91,13.95 8.97,13.89 9.59,13.89 9.92,13.56 U$21.11-SDO | 8.91,13.95
SPI_MOSI  (via drill 0.2)
  Top 0.089: U2.14 10.23,16.02 9.17,14.95 v9.17,14.57
  Bottom 0.089: 10.42,13.57 U$21.10-SDI 10.42,13.56 10.09,13.89 9.85,13.89 v9.17,14.57
SPI_SCK  (via drill 0.2)
  Top 0.089: U2.12 9.97,17.01 9.93,16.97 9.6,16.97 9.37,16.74 8.9,16.74 v8.83,16.8
  Bottom 0.089: U$21.12-SCLK 8.63,13.98 8.63,15.8 8.73,15.91 8.73,16.16 8.83,16.26 v8.83,16.8
SWCLK  (via drill 0.2)
  Top 0.089: U2.28 v15.84,14.01
  Route2 0.089: v16.87,22.91 16.7,22.73 16.7,20.93 16.47,20.7 16.47,15.05 15.84,14.42 v15.84,14.01
  Bottom 0.089: U$1.P$2 14.33,24.32 14.45,24.21 15.18,24.21 15.72,23.66 16.12,23.66 v16.87,22.91
SWDIO  (via drill 0.2)
  Top 0.089: U2.25 14.68,13.37 14.68,13.67 14.76,13.75 15.1,13.75 15.18,13.67 15.18,12.52 v15.43,12.27
  Route2 0.089: v17.16,23.39 17.16,23.13 17.23,23.06 17.23,21.21 16.65,20.63 16.65,14.61 16.2,14.16 16.2,13.87 15.9,13.56 15.9,12.96 15.43,12.5 v15.43,12.27
  Bottom 0.089: U$1.P$1 14.73,24.43 14.78,24.38 15.25,24.38 15.79,23.84 16.19,23.84 16.64,23.39 v17.16,23.39
VA_  (3 unrouted)
VB_  (3 unrouted)
VC_  (3 unrouted)
VMOTOR  (via drill 1)  (12 unrouted)
  Top 0.089: 0001.2 4.46,15.96 v4.42,16
  Top 0.152: R13.2 20.16,17.25 v21.44,17.25
  Route15 0.152: v4.42,18.51 7.66,18.51 | 9.86,18.51 v21.44,18.51
  Bottom 0.152: U$21.41-PVDD 16.98,18.18 17.01,18.22 19.73,18.22 C14.1 C13.1 | C41.1 C43.1 | C30.1 C33.1 5.98,18.51 v4.42,18.51 v4.42,17.25 v4.42,16
  other vias: 21.44,13.48 21.44,14.74 21.44,16 4.42,13.48 4.42,14.74 4.42,39.95 4.42,38.7 4.42,37.44 21.44,39.95 21.44,38.7 21.44,37.44 21.44,36.18 4.42,36.18 21.44,34.93 4.42,34.93
  pour Top (rank 3, no thermals): 4.42,41.81 21.44,41.81 21.44,35.8 20.93,35.8 19.82,36.91 4.42,36.91
  pour Route15 (no thermals): 4.42,35.69 4.42,41.81 15.31,41.81 21.44,41.81 21.44,37.29 21.44,35.69
  pour Route2 (no thermals): 4.42,41.81 21.44,41.81 21.44,35.69 4.42,35.69
VMOTOR1  (via drill 1)  (4 unrouted)
  other vias: 47.16,17.92 47.16,16.66 47.16,15.41 47.16,14.15 47.16,12.89
VMOTOR_  (7 unrouted)
  Top 0.089: C11.1 45.81,15.39 C16.1 44.95,15.02 44.16,15.02 44.08,14.94 44.08,13.49 43.91,13.32 43.91,12.79 43.76,12.64 U$13.41-PVDD
VMOTOR_TOP2  (via drill 1)  (4 unrouted)
  other vias: 30.14,17.92 30.14,16.66 30.14,15.41 30.14,14.15 30.14,12.89
VV_  (3 unrouted)